# EAGLE design APRDL_2016_4L (EAGLE 7.2.0)
Assembly variants: X4

## Sheet 1 of 4
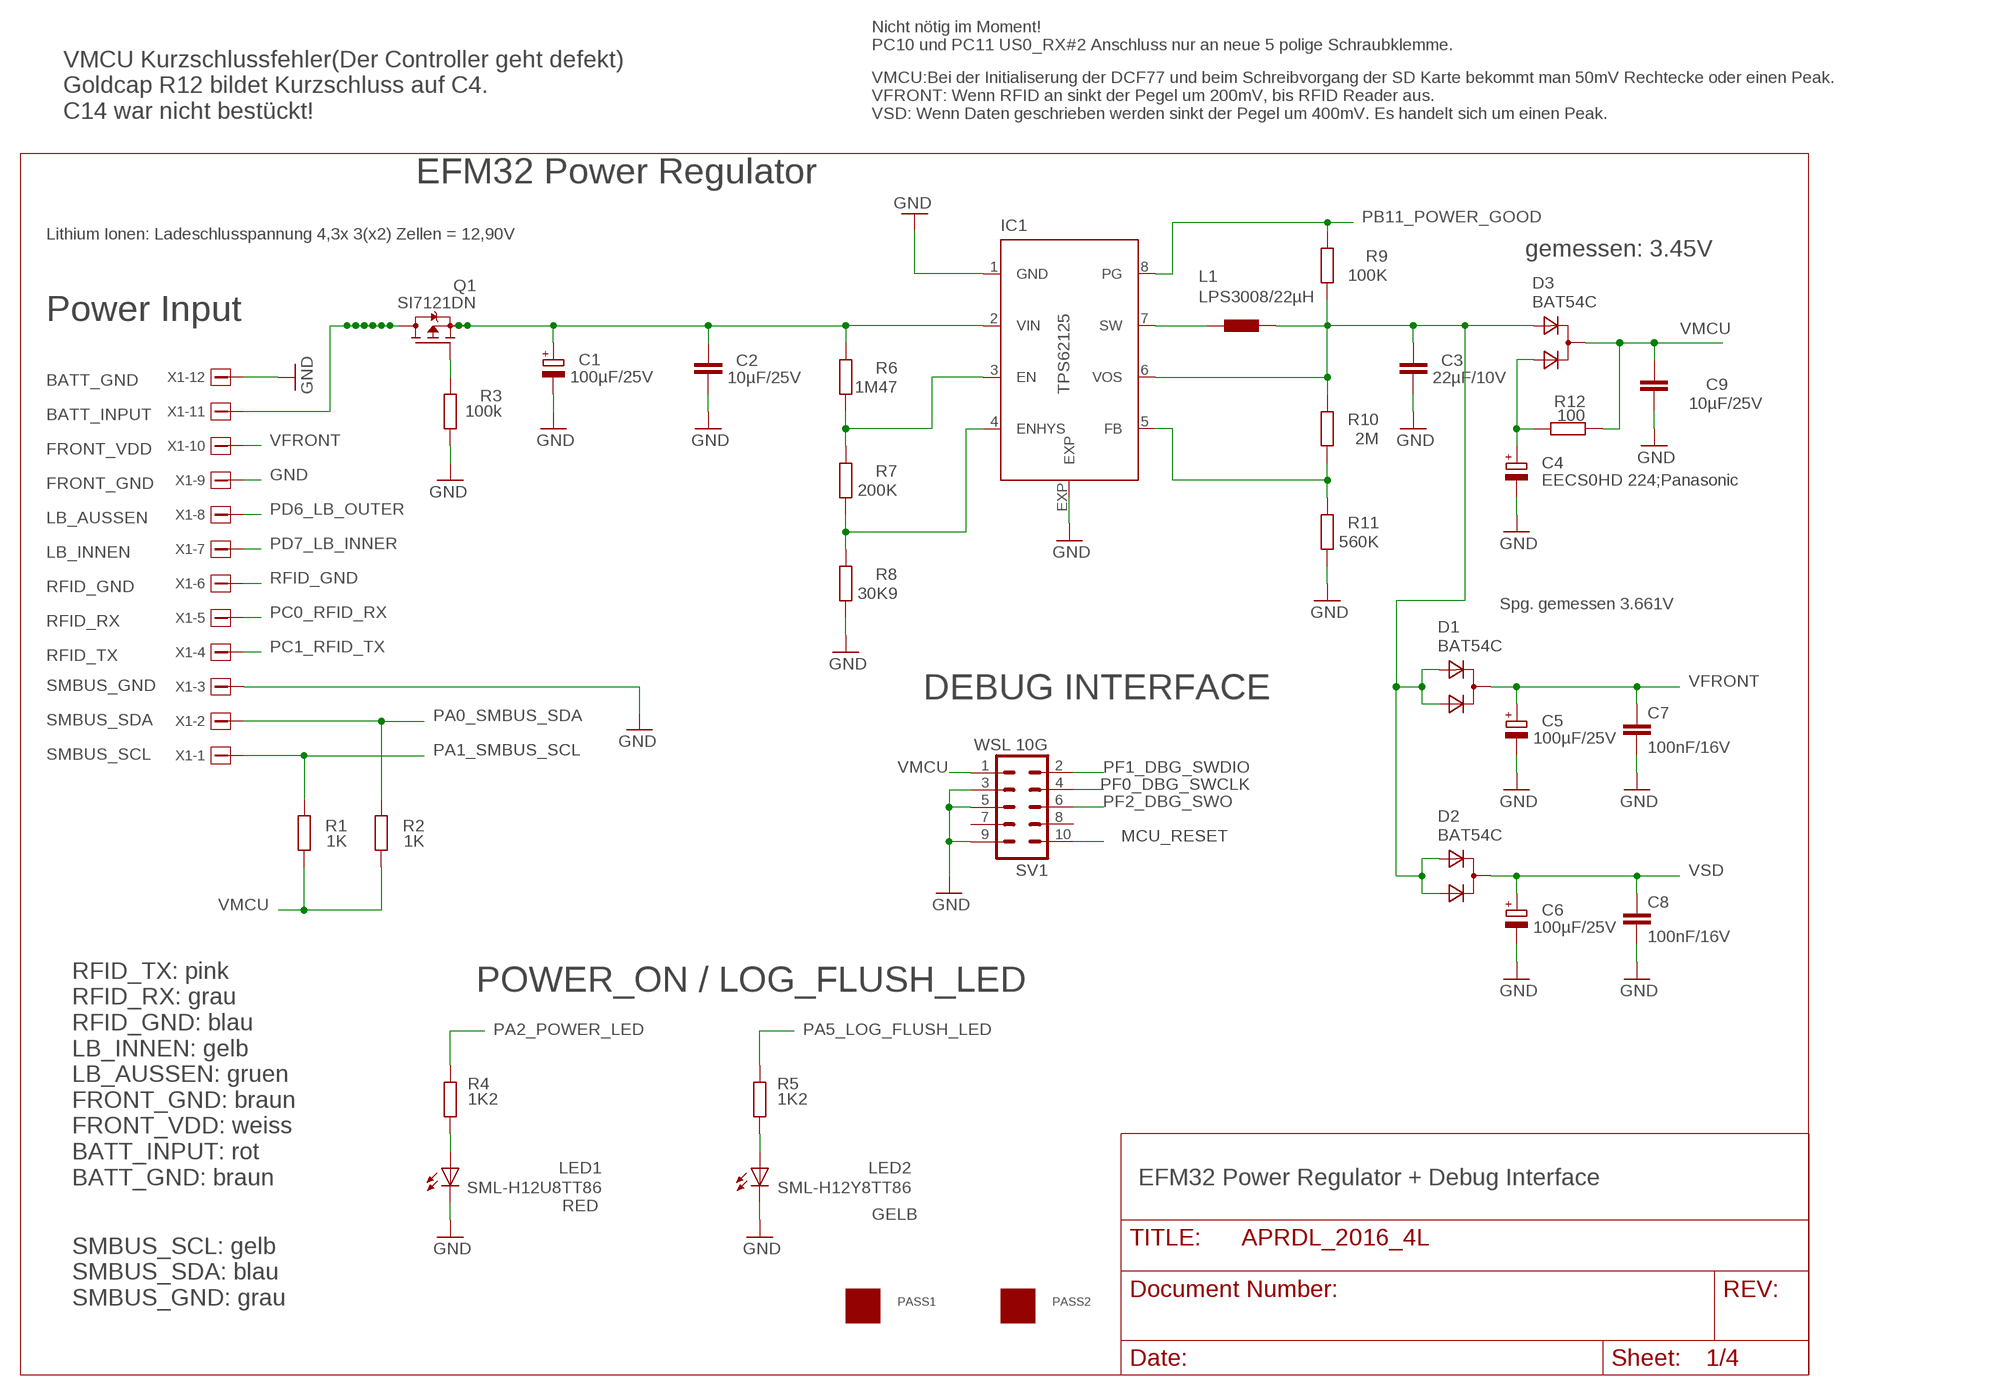
[diagram p0: schematic, sheet 1]

### Parts
C1  100µF/25V  CPOL-EUE  [PANASONIC_E]
C2  10µF/25V  C-EUC1206  [C1206]
C3  22µF/10V  C-EUC1206  [C1206]
C4  EECS0HD 224;Panasonic  GOLDCAPSPK-V  [GOLDCAPSPK-V]
C5  100µF/25V  CPOL-EUE  [PANASONIC_E]
C6  100µF/25V  CPOL-EUE  [PANASONIC_E]
C7  100nF/16V  C-EUC0805  [C0805]
C8  100nF/16V  C-EUC0805  [C0805]
C9  10µF/25V  C-EUC1206  [C1206]
D1  BAT54C  D2A_SOT23  [SOT-23@1]
D2  BAT54C  D2A_SOT23  [SOT-23@1]
D3  BAT54C  D2A_SOT23  [SOT-23@1]
IC1  TPS62125  [DSG_PWSO-N8_EXP]
L1  LPS3008/22µH  LPS3008  [LPS3008]
LED1  SML-H12U8TT86  LEDCHIPLED_0805  [CHIPLED_0805]
LED2  SML-H12Y8TT86  LEDCHIPLED_0805  [CHIPLED_0805]
PASS1  ROUND_1MM1.5  [ROUND2_1.5MM]
PASS2  ROUND_1MM1.5  [ROUND2_1.5MM]
Q1  SI7121DN  TRANSISTOR-FET_SI7113DN  [TRANSISTOR-FET_1212-8S]
R1  1K  R-EU_R0805  [R0805]
R2  1K  R-EU_R0805  [R0805]
R3  100k  R-EU_R0805  [R0805]
R4  1K2  R-EU_R0805  [R0805]
R5  1K2  R-EU_R0805  [R0805]
R6  1M47  R-EU_R0805  [R0805]
R7  200K  R-EU_R0805  [R0805]
R8  30K9  R-EU_R0805  [R0805]
R9  100K  R-EU_R0805  [R0805]
R10  2M  R-EU_R0805  [R0805]
R11  560K  R-EU_R0805  [R0805]
R12  100  R-EU_R0805  [R0805]
SV1  WSL 10G  ML10  [ML10]
X1  1803523  [1803523]

### Nets
BATT_INPUT: Q1.5(D) Q1.6(D) Q1.7(D) Q1.8(D) Q1.9(D) Q1.10(D) Q1.11(D) X1.11
GND: C1.- C2.2 C3.2 C4.- C5.- C6.- C7.2 C8.2 C9.1 IC1.1(GND) IC1.EXP LED1.C LED2.C R3.1 R8.1 R11.1 SV1.3 SV1.5 SV1.9 X1.3 X1.9 X1.12 ; also sheet 2,3,4
MCU_RESET: SV1.10 ; also sheet 2,3
N$1: IC1.3(EN) R6.1 R7.2
N$5: IC1.4(ENHYS) R7.1 R8.2
N$9: IC1.7(SW) L1.1
N$13: C1.+ C2.1 IC1.2(VIN) Q1.1(S) Q1.2(S) Q1.3(S) R6.2
N$17: LED2.A R5.2
N$19: IC1.5(FB) R10.1 R11.2
N$20: Q1.4(G) R3.2
N$21: C4.+ D3.2(A1) R12.2
N$29: LED1.A R4.2
PA0_SMBUS_SDA: R2.2 X1.2 ; also sheet 2
PA1_SMBUS_SCL: R1.2 X1.1 ; also sheet 2
PA2_POWER_LED: R4.1 ; also sheet 2
PA5_LOG_FLUSH_LED: R5.1 ; also sheet 2
PB11_POWER_GOOD: IC1.8(PG) R9.2 ; also sheet 2
PC0_RFID_RX: X1.5 ; also sheet 2
PC1_RFID_TX: X1.4 ; also sheet 2
PD6_LB_OUTER: X1.8 ; also sheet 2
PD7_LB_INNER: X1.7 ; also sheet 2
PF0_DBG_SWCLK: SV1.4 ; also sheet 2
PF1_DBG_SWDIO: SV1.2 ; also sheet 2
PF2_DBG_SWO: SV1.6 ; also sheet 2
RFID_GND: X1.6 ; also sheet 4
V1: C3.1 D1.2(A1) D1.3(A2) D2.2(A1) D2.3(A2) D3.3(A2) IC1.6(VOS) L1.2 R9.1 R10.2
VFRONT: C5.+ C7.1 D1.1(C) X1.10
VMCU: C9.2 D3.1(C) R1.1 R2.1 R12.1 SV1.1 ; also sheet 2,3,4
VSD: C6.+ C8.1 D2.1(C) ; also sheet 3
Unconnected: SV1.7 SV1.8

### Notes on the sheet
- Nicht nötig im Moment!
  PC10 und PC11 US0_RX#2 Anschluss nur an neue 5 polige Schraubklemme.
- VMCU Kurzschlussfehler(Der Controller geht defekt)
  Goldcap R12 bildet Kurzschluss auf C4.
  C14 war nicht bestückt!
- VMCU:Bei der Initialiserung der DCF77 und beim Schreibvorgang der SD Karte bekommt man 50mV Rechtecke oder einen Peak.
  VFRONT: Wenn RFID an sinkt der Pegel um 200mV, bis RFID Reader aus.
  VSD: Wenn Daten geschrieben werden sinkt der Pegel um 400mV. Es handelt sich um einen Peak.
- EFM32 Power Regulator
- Lithium Ionen: Ladeschlusspannung 4,3x 3(x2) Zellen = 12,90V
- gemessen: 3.45V
- Power Input
- BATT_GND
- BATT_INPUT
- FRONT_VDD
- FRONT_GND
- LB_AUSSEN
- LB_INNEN
- RFID_GND
- Spg. gemessen 3.661V
- RFID_RX
- RFID_TX
- SMBUS_GND
- DEBUG INTERFACE
- SMBUS_SDA
- SMBUS_SCL
- POWER_ON / LOG_FLUSH_LED
- RFID_TX: pink
  RFID_RX: grau
  RFID_GND: blau
  LB_INNEN: gelb
  LB_AUSSEN: gruen
  FRONT_GND: braun
  FRONT_VDD: weiss
  BATT_INPUT: rot
  BATT_GND: braun
- EFM32 Power Regulator + Debug Interface
- RED
- GELB
- SMBUS_SCL: gelb
  SMBUS_SDA: blau
  SMBUS_GND: grau

## Sheet 2 of 4
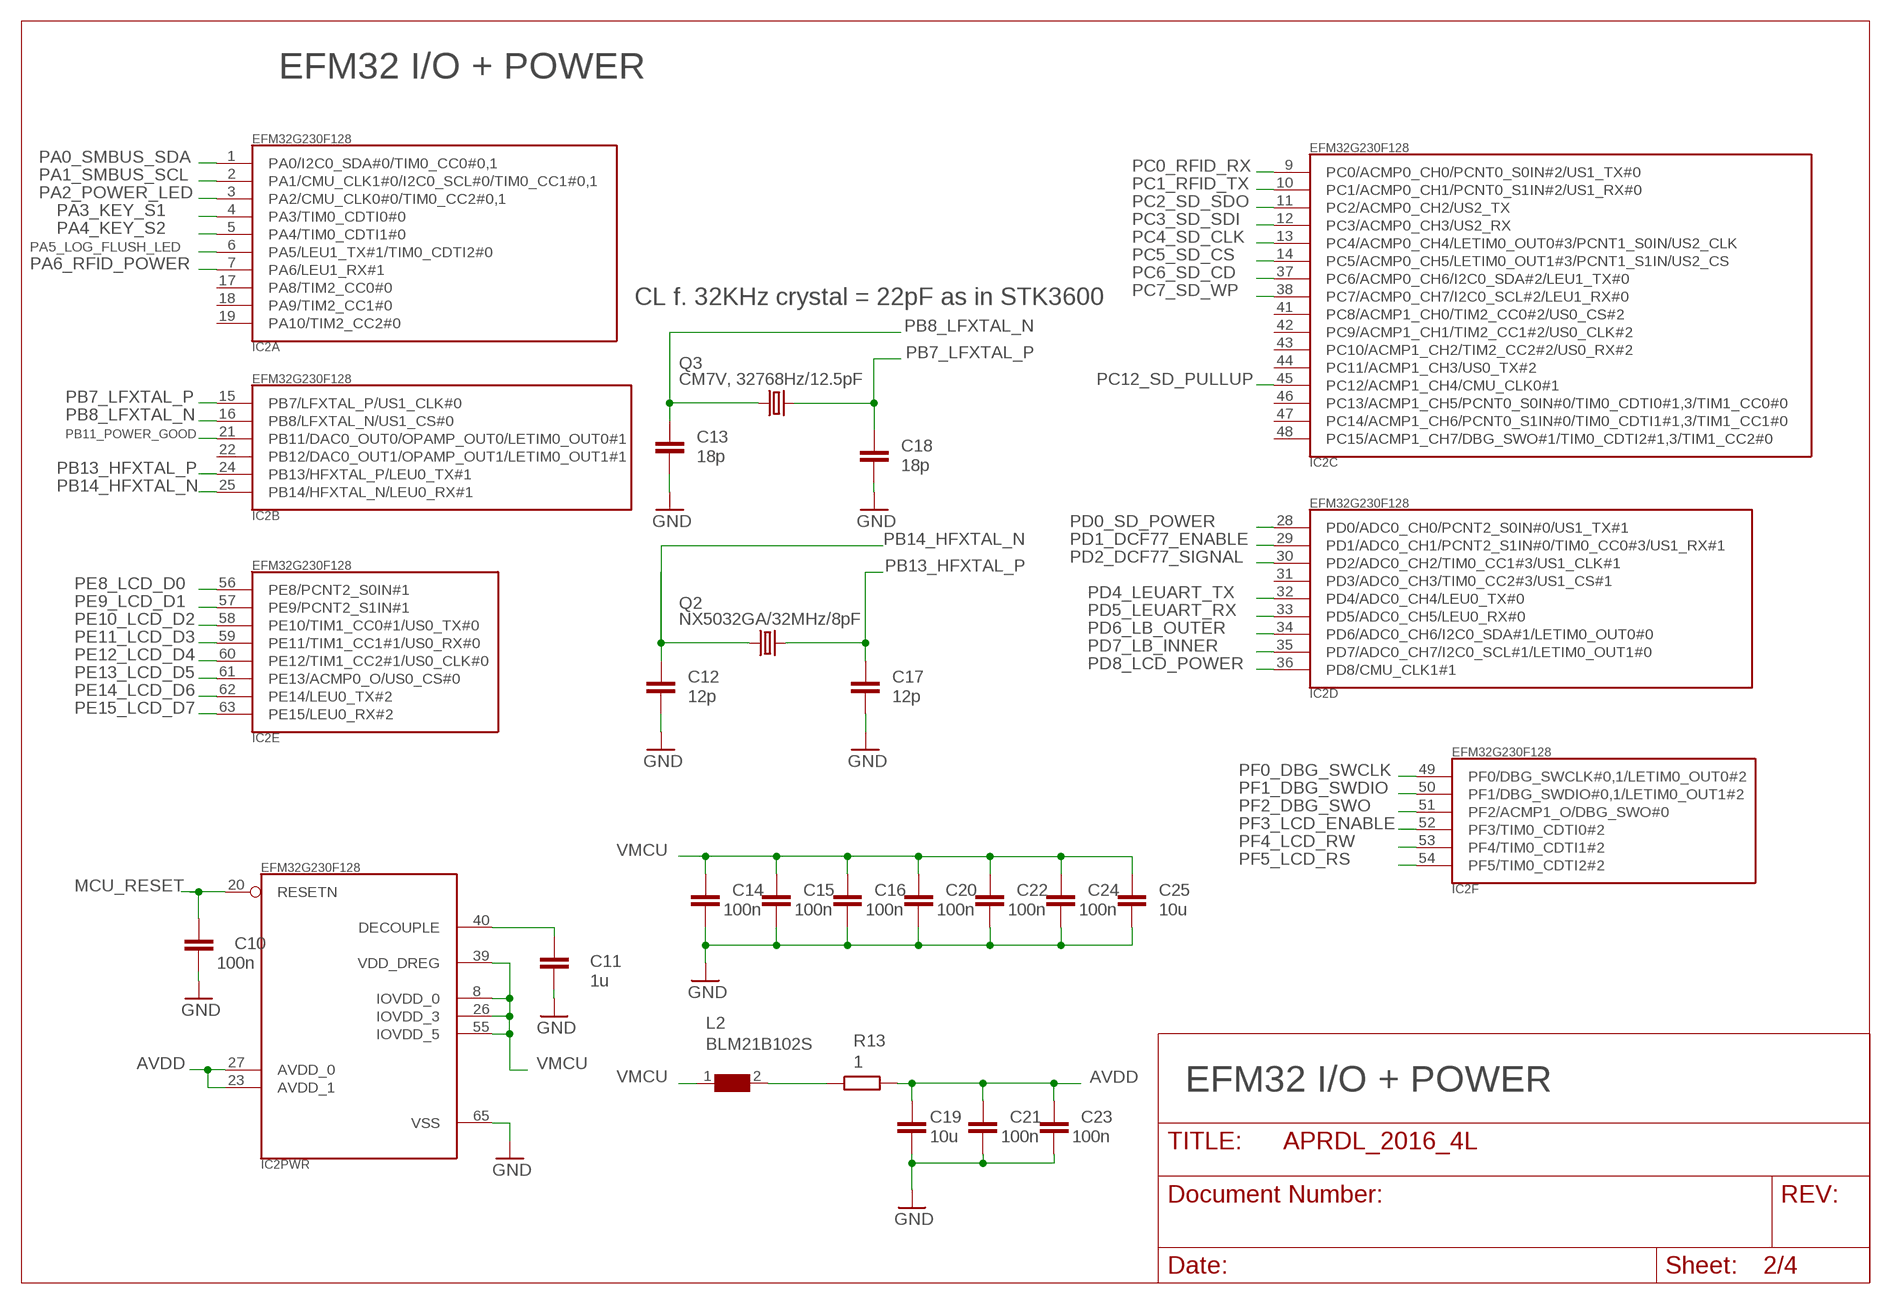
[diagram p1: schematic, sheet 2]

### Parts
C10  100n  C-EUC0805  [C0805]
C11  1u  C-EUC0805  [C0805]
C12  12p  C-EUC0805  [C0805]
C13  18p  C-EUC0805  [C0805]
C14  100n  C-EUC0805  [C0805]
C15  100n  C-EUC0805  [C0805]
C16  100n  C-EUC0805  [C0805]
C17  12p  C-EUC0805  [C0805]
C18  18p  C-EUC0805  [C0805]
C19  10u  C-EUC0805  [C0805]
C20  100n  C-EUC0805  [C0805]
C21  100n  C-EUC0805  [C0805]
C22  100n  C-EUC0805  [C0805]
C23  100n  C-EUC0805  [C0805]
C24  100n  C-EUC0805  [C0805]
C25  10u  C-EUC0805  [C0805]
IC2  EFM32G230F128  [QFN64]
L2  BLM21B102S  WE-CBF-7427920_0805  [0805]
Q2  NX5032GA/32MHz/8pF  CRYSTAL2P5.0X3.2  [CRYSTAL2P5.0X3.2]
Q3  CM7V, 32768Hz/12.5pF  CRYSTAL2P  [CRYSTAL2P3.2X1.5]
R13  1  R-EU_R0805  [R0805]

### Nets
AVDD [VCC]: C19.2 C21.2 C23.2 IC2.23(PWR:AVDD_1) IC2.27(PWR:AVDD_0) R13.2
GND: C10.1 C11.1 C12.1 C13.1 C14.1 C15.1 C16.1 C17.1 C18.1 C19.1 C20.1 C21.1 C22.1 C23.1 C24.1 C25.1 IC2.65(PWR:VSS) ; also sheet 1,3,4
MCU_RESET: C10.2 IC2.20(PWR:RESETN) ; also sheet 1,3
N$3: L2.2 R13.1
N$30: C11.2 IC2.40(PWR:DECOUPLE)
PA0_SMBUS_SDA: IC2.1(A:PA0/I2C0_SDA#0/TIM0_CC0#0,1) ; also sheet 1
PA1_SMBUS_SCL: IC2.2(A:PA1/CMU_CLK1#0/I2C0_SCL#0/TIM0_CC1#0,1) ; also sheet 1
PA2_POWER_LED: IC2.3(A:PA2/CMU_CLK0#0/TIM0_CC2#0,1) ; also sheet 1
PA3_KEY_S1: IC2.4(A:PA3/TIM0_CDTI0#0) ; also sheet 3
PA4_KEY_S2: IC2.5(A:PA4/TIM0_CDTI1#0) ; also sheet 3
PA5_LOG_FLUSH_LED: IC2.6(A:PA5/LEU1_TX#1/TIM0_CDTI2#0) ; also sheet 1
PA6_RFID_POWER: IC2.7(A:PA6/LEU1_RX#1) ; also sheet 4
PB7_LFXTAL_P: C18.2 IC2.15(B:PB7/LFXTAL_P/US1_CLK#0) Q3.2
PB8_LFXTAL_N: C13.2 IC2.16(B:PB8/LFXTAL_N/US1_CS#0) Q3.1
PB11_POWER_GOOD: IC2.21(B:PB11/DAC0_OUT0/OPAMP_OUT0/LETIM0_OUT0#1) ; also sheet 1
PB13_HFXTAL_P: C17.2 IC2.24(B:PB13/HFXTAL_P/LEU0_TX#1) Q2.2
PB14_HFXTAL_N: C12.2 IC2.25(B:PB14/HFXTAL_N/LEU0_RX#1) Q2.1
PC0_RFID_RX: IC2.9(C:PC0/ACMP0_CH0/PCNT0_S0IN#2/US1_TX#0) ; also sheet 1
PC1_RFID_TX: IC2.10(C:PC1/ACMP0_CH1/PCNT0_S1IN#2/US1_RX#0) ; also sheet 1
PC2_SD_SDO: IC2.11(C:PC2/ACMP0_CH2/US2_TX) ; also sheet 3
PC3_SD_SDI: IC2.12(C:PC3/ACMP0_CH3/US2_RX) ; also sheet 3
PC4_SD_CLK: IC2.13(C:PC4/ACMP0_CH4/LETIM0_OUT0#3/PCNT1_S0IN/US2_CLK) ; also sheet 3
PC5_SD_CS: IC2.14(C:PC5/ACMP0_CH5/LETIM0_OUT1#3/PCNT1_S1IN/US2_CS) ; also sheet 3
PC6_SD_CD: IC2.37(C:PC6/ACMP0_CH6/I2C0_SDA#2/LEU1_TX#0) ; also sheet 3
PC7_SD_WP: IC2.38(C:PC7/ACMP0_CH7/I2C0_SCL#2/LEU1_RX#0) ; also sheet 3
PC12_SD_PULLUP: IC2.45(C:PC12/ACMP1_CH4/CMU_CLK0#1) ; also sheet 3
PD0_SD_POWER: IC2.28(D:PD0/ADC0_CH0/PCNT2_S0IN#0/US1_TX#1) ; also sheet 3
PD1_DCF77_ENABLE: IC2.29(D:PD1/ADC0_CH1/PCNT2_S1IN#0/TIM0_CC0#3/US1_RX#1) ; also sheet 3
PD2_DCF77_SIGNAL: IC2.30(D:PD2/ADC0_CH2/TIM0_CC1#3/US1_CLK#1) ; also sheet 3
PD4_LEUART_TX: IC2.32(D:PD4/ADC0_CH4/LEU0_TX#0) ; also sheet 3
PD5_LEUART_RX: IC2.33(D:PD5/ADC0_CH5/LEU0_RX#0) ; also sheet 3
PD6_LB_OUTER: IC2.34(D:PD6/ADC0_CH6/I2C0_SDA#1/LETIM0_OUT0#0) ; also sheet 1
PD7_LB_INNER: IC2.35(D:PD7/ADC0_CH7/I2C0_SCL#1/LETIM0_OUT1#0) ; also sheet 1
PD8_LCD_POWER: IC2.36(D:PD8/CMU_CLK1#1) ; also sheet 4
PE8_LCD_D0: IC2.56(E:PE8/PCNT2_S0IN#1) ; also sheet 4
PE9_LCD_D1: IC2.57(E:PE9/PCNT2_S1IN#1) ; also sheet 4
PE10_LCD_D2: IC2.58(E:PE10/TIM1_CC0#1/US0_TX#0) ; also sheet 4
PE11_LCD_D3: IC2.59(E:PE11/TIM1_CC1#1/US0_RX#0) ; also sheet 4
PE12_LCD_D4: IC2.60(E:PE12/TIM1_CC2#1/US0_CLK#0) ; also sheet 4
PE13_LCD_D5: IC2.61(E:PE13/ACMP0_O/US0_CS#0) ; also sheet 4
PE14_LCD_D6: IC2.62(E:PE14/LEU0_TX#2) ; also sheet 4
PE15_LCD_D7: IC2.63(E:PE15/LEU0_RX#2) ; also sheet 4
PF0_DBG_SWCLK: IC2.49(F:PF0/DBG_SWCLK#0,1/LETIM0_OUT0#2) ; also sheet 1
PF1_DBG_SWDIO: IC2.50(F:PF1/DBG_SWDIO#0,1/LETIM0_OUT1#2) ; also sheet 1
PF2_DBG_SWO: IC2.51(F:PF2/ACMP1_O/DBG_SWO#0) ; also sheet 1
PF3_LCD_ENABLE: IC2.52(F:PF3/TIM0_CDTI0#2) ; also sheet 4
PF4_LCD_RW: IC2.53(F:PF4/TIM0_CDTI1#2) ; also sheet 4
PF5_LCD_RS: IC2.54(F:PF5/TIM0_CDTI2#2) ; also sheet 4
VMCU: C14.2 C15.2 C16.2 C20.2 C22.2 C24.2 C25.2 IC2.8(PWR:IOVDD_0) IC2.26(PWR:IOVDD_3) IC2.39(PWR:VDD_DREG) IC2.55(PWR:IOVDD_5) L2.1 ; also sheet 1,3,4
Unconnected: IC2.17(A:PA8/TIM2_CC0#0) IC2.18(A:PA9/TIM2_CC1#0) IC2.19(A:PA10/TIM2_CC2#0) IC2.22(B:PB12/DAC0_OUT1/OPAMP_OUT1/LETIM0_OUT1#1) IC2.31(D:PD3/ADC0_CH3/TIM0_CC2#3/US1_CS#1) IC2.41(C:PC8/ACMP1_CH0/TIM2_CC0#2/US0_CS#2) IC2.42(C:PC9/ACMP1_CH1/TIM2_CC1#2/US0_CLK#2) IC2.43(C:PC10/ACMP1_CH2/TIM2_CC2#2/US0_RX#2) IC2.44(C:PC11/ACMP1_CH3/US0_TX#2) IC2.46(C:PC13/ACMP1_CH5/PCNT0_S0IN#0/TIM0_CDTI0#1,3/TIM1_CC0#0) IC2.47(C:PC14/ACMP1_CH6/PCNT0_S1IN#0/TIM0_CDTI1#1,3/TIM1_CC1#0) IC2.48(C:PC15/ACMP1_CH7/DBG_SWO#1/TIM0_CDTI2#1,3/TIM1_CC2#0)

### Notes on the sheet
- EFM32 I/O + POWER
- CL f. 32KHz crystal = 22pF as in STK3600
- EFM32 I/O + POWER

## Sheet 3 of 4
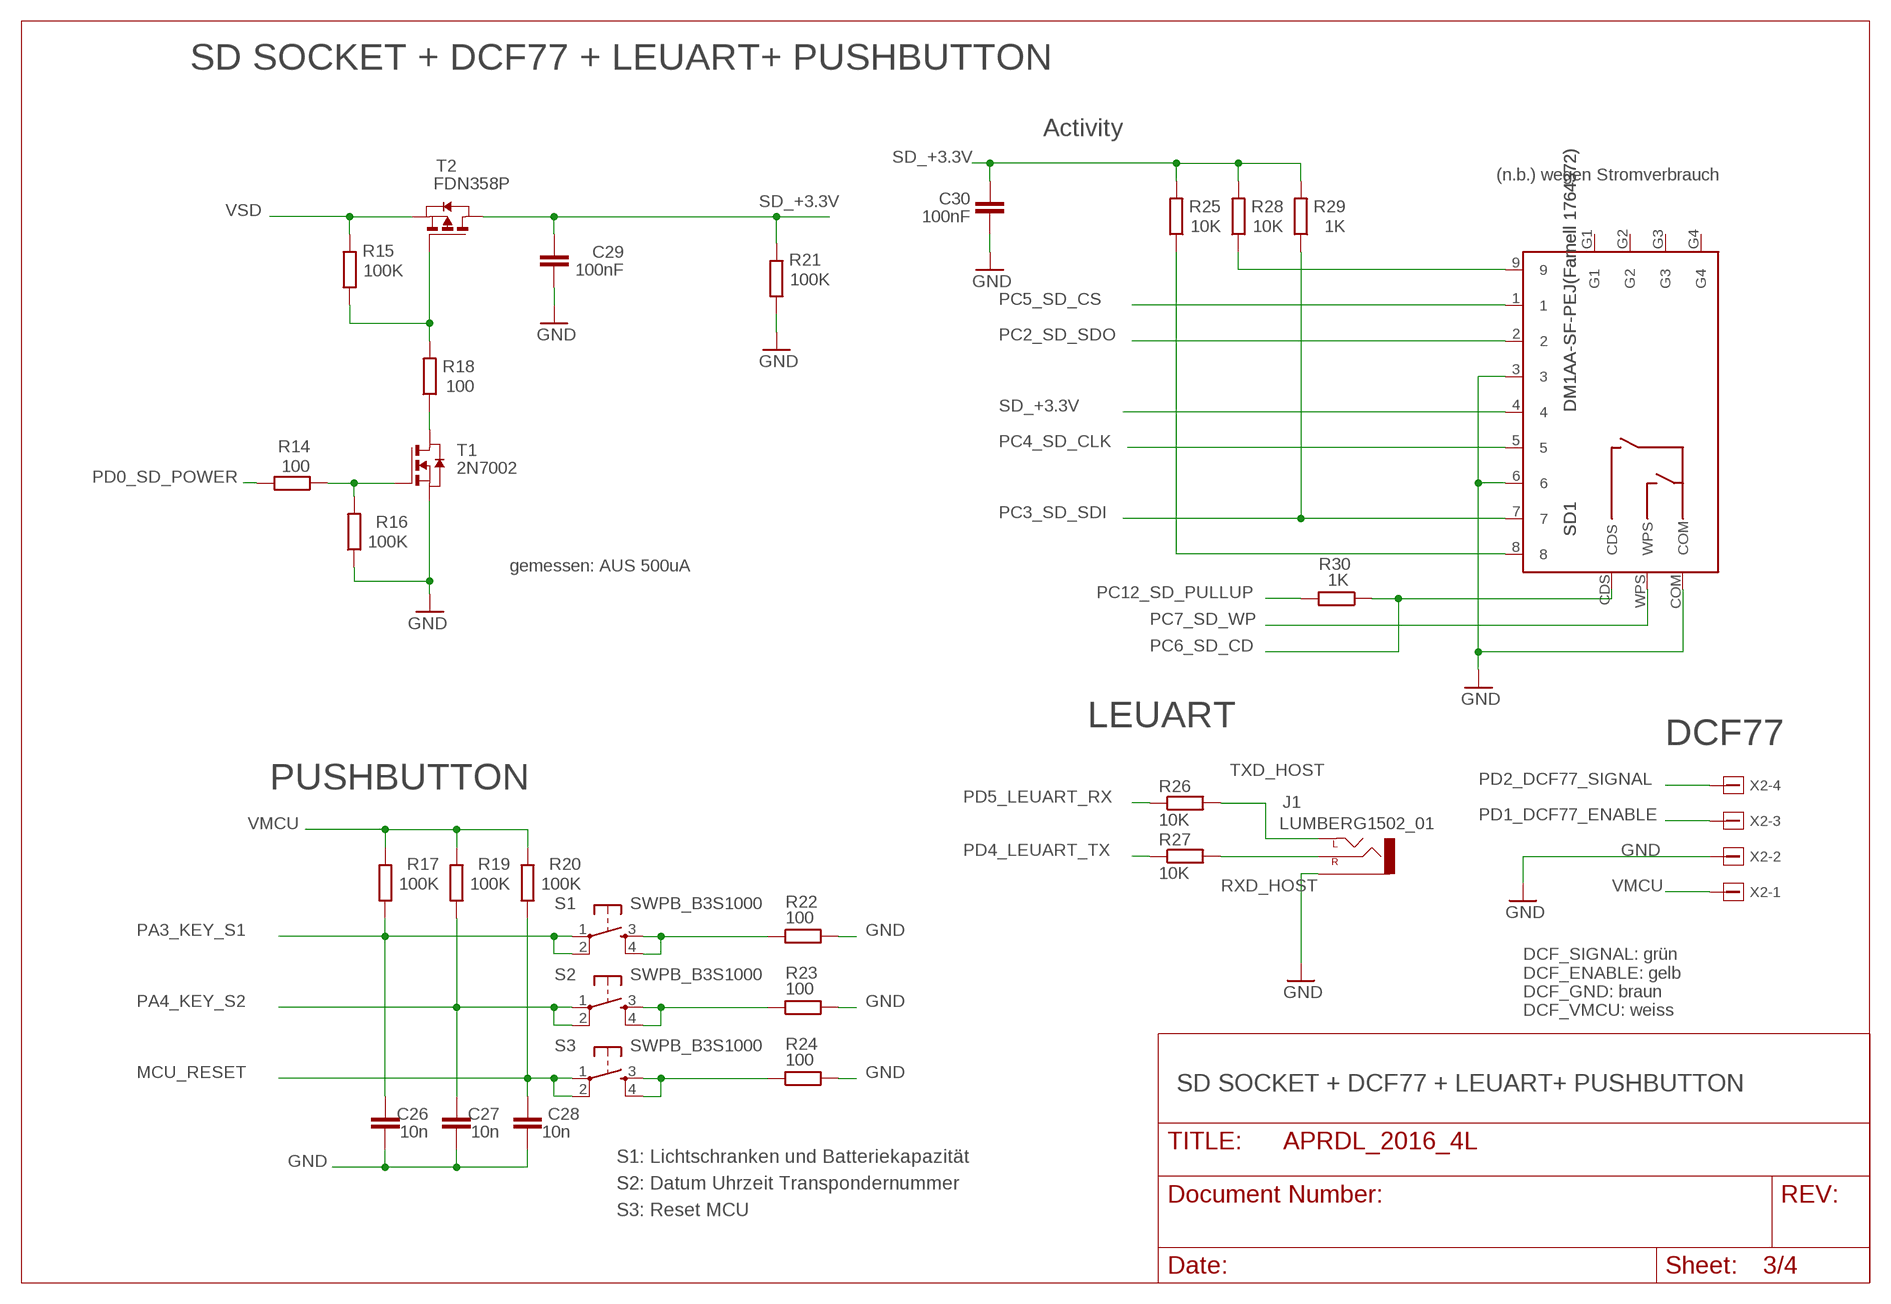
[diagram p2: schematic, sheet 3]

### Parts
C26  10n  C-EUC0603  [C0603]
C27  10n  C-EUC0603  [C0603]
C28  10n  C-EUC0603  [C0603]
C29  100nF  C-EUC0603  [C0603]
C30  100nF  C-EUC0603  [C0603]
J1  LUMBERG1502_01  [LUMBERG1502_01]
R14  100  R-EU_R0805  [R0805]
R15  100K  R-EU_R0805  [R0805]
R16  100K  R-EU_R0805  [R0805]
R17  100K  R-EU_R0805  [R0805]
R18  100  R-EU_R0805  [R0805]
R19  100K  R-EU_R0805  [R0805]
R20  100K  R-EU_R0805  [R0805]
R21  100K  R-EU_R0805  [R0805]
R22  100  R-EU_R0805  [R0805]
R23  100  R-EU_R0805  [R0805]
R24  100  R-EU_R0805  [R0805]
R25  10K  R-EU_R0805  [R0805]
R26  10K  R-EU_R0805  [R0805]
R27  10K  R-EU_R0805  [R0805]
R28  10K  R-EU_R0805  [R0805]
R29  1K  R-EU_R0805  [R0805]
R30  1K  R-EU_R0805  [R0805]
S1  SWPB_B3S1000  DTSM-6  [DTSM-6]
S2  SWPB_B3S1000  DTSM-6  [DTSM-6]
S3  SWPB_B3S1000  DTSM-6  [DTSM-6]
SD1  DM1AA-SF-PEJ(Farnell 1764372)  DM1AA-SF-PEJ  [DM1AA-SF-PEJ]
T1  2N7002  ZETEX_NMOSSOT23  [ZETEX_SOT-23]
T2  FDN358P  ZETEX_PMOSSOT23  [ZETEX_SOT-23]
X2  1803442  [1803442]

### Nets
GND: C26.1 C27.1 C28.1 C29.2 C30.2 J1.P$1(1-SLEEVE) R16.1 R21.1 R22.2 R23.2 R24.2 SD1.3 SD1.6 SD1.COM T1.2(S) X2.2 ; also sheet 1,2,4
MCU_RESET: C28.2 R20.1 S3.1 S3.2 ; also sheet 1,2
N$4: R15.1 R18.2 T2.3(G)
N$7: R18.1 T1.1(D)
N$11: R14.1 R16.2 T1.3(G)
N$16: R28.1 SD1.9
N$18: R25.1 SD1.8
N$23: R22.1 S1.3 S1.4
N$24: R23.1 S2.3 S2.4
N$26: R24.1 S3.3 S3.4
PA3_KEY_S1: C26.2 R17.1 S1.1 S1.2 ; also sheet 2
PA4_KEY_S2: C27.2 R19.1 S2.1 S2.2 ; also sheet 2
PC2_SD_SDO: SD1.2 ; also sheet 2
PC3_SD_SDI: R29.1 SD1.7 ; also sheet 2
PC4_SD_CLK: SD1.5 ; also sheet 2
PC5_SD_CS: SD1.1 ; also sheet 2
PC6_SD_CD: R30.1 SD1.CDS ; also sheet 2
PC7_SD_WP: SD1.WPS ; also sheet 2
PC12_SD_PULLUP: R30.2 ; also sheet 2
PD0_SD_POWER: R14.2 ; also sheet 2
PD1_DCF77_ENABLE: X2.3 ; also sheet 2
PD2_DCF77_SIGNAL: X2.4 ; also sheet 2
PD4_LEUART_TX: R27.1 ; also sheet 2
PD5_LEUART_RX: R26.1 ; also sheet 2
RXD_HOST: J1.P$3(3-RIGHT) R27.2
SD_+3.3V: C29.1 C30.1 R21.2 R25.2 R28.2 R29.2 SD1.4 T2.1(D)
TXD_HOST: J1.P$2(2-LEFT) R26.2
VMCU: R17.2 R19.2 R20.2 X2.1 ; also sheet 1,2,4
VSD: R15.2 T2.2(S) ; also sheet 1
Unconnected: SD1.G1 SD1.G2 SD1.G3 SD1.G4

### Notes on the sheet
- SD SOCKET + DCF77 + LEUART+ PUSHBUTTON
- Activity
- (n.b.) wegen Stromverbrauch
- gemessen: AUS 500uA
- LEUART
- DCF77
- PUSHBUTTON
- DCF_SIGNAL: grün
  DCF_ENABLE: gelb
  DCF_GND: braun
  DCF_VMCU: weiss
- SD SOCKET + DCF77 + LEUART+ PUSHBUTTON
- S1: Lichtschranken und Batteriekapazität
- S2: Datum Uhrzeit Transpondernummer
- S3: Reset MCU

## Sheet 4 of 4
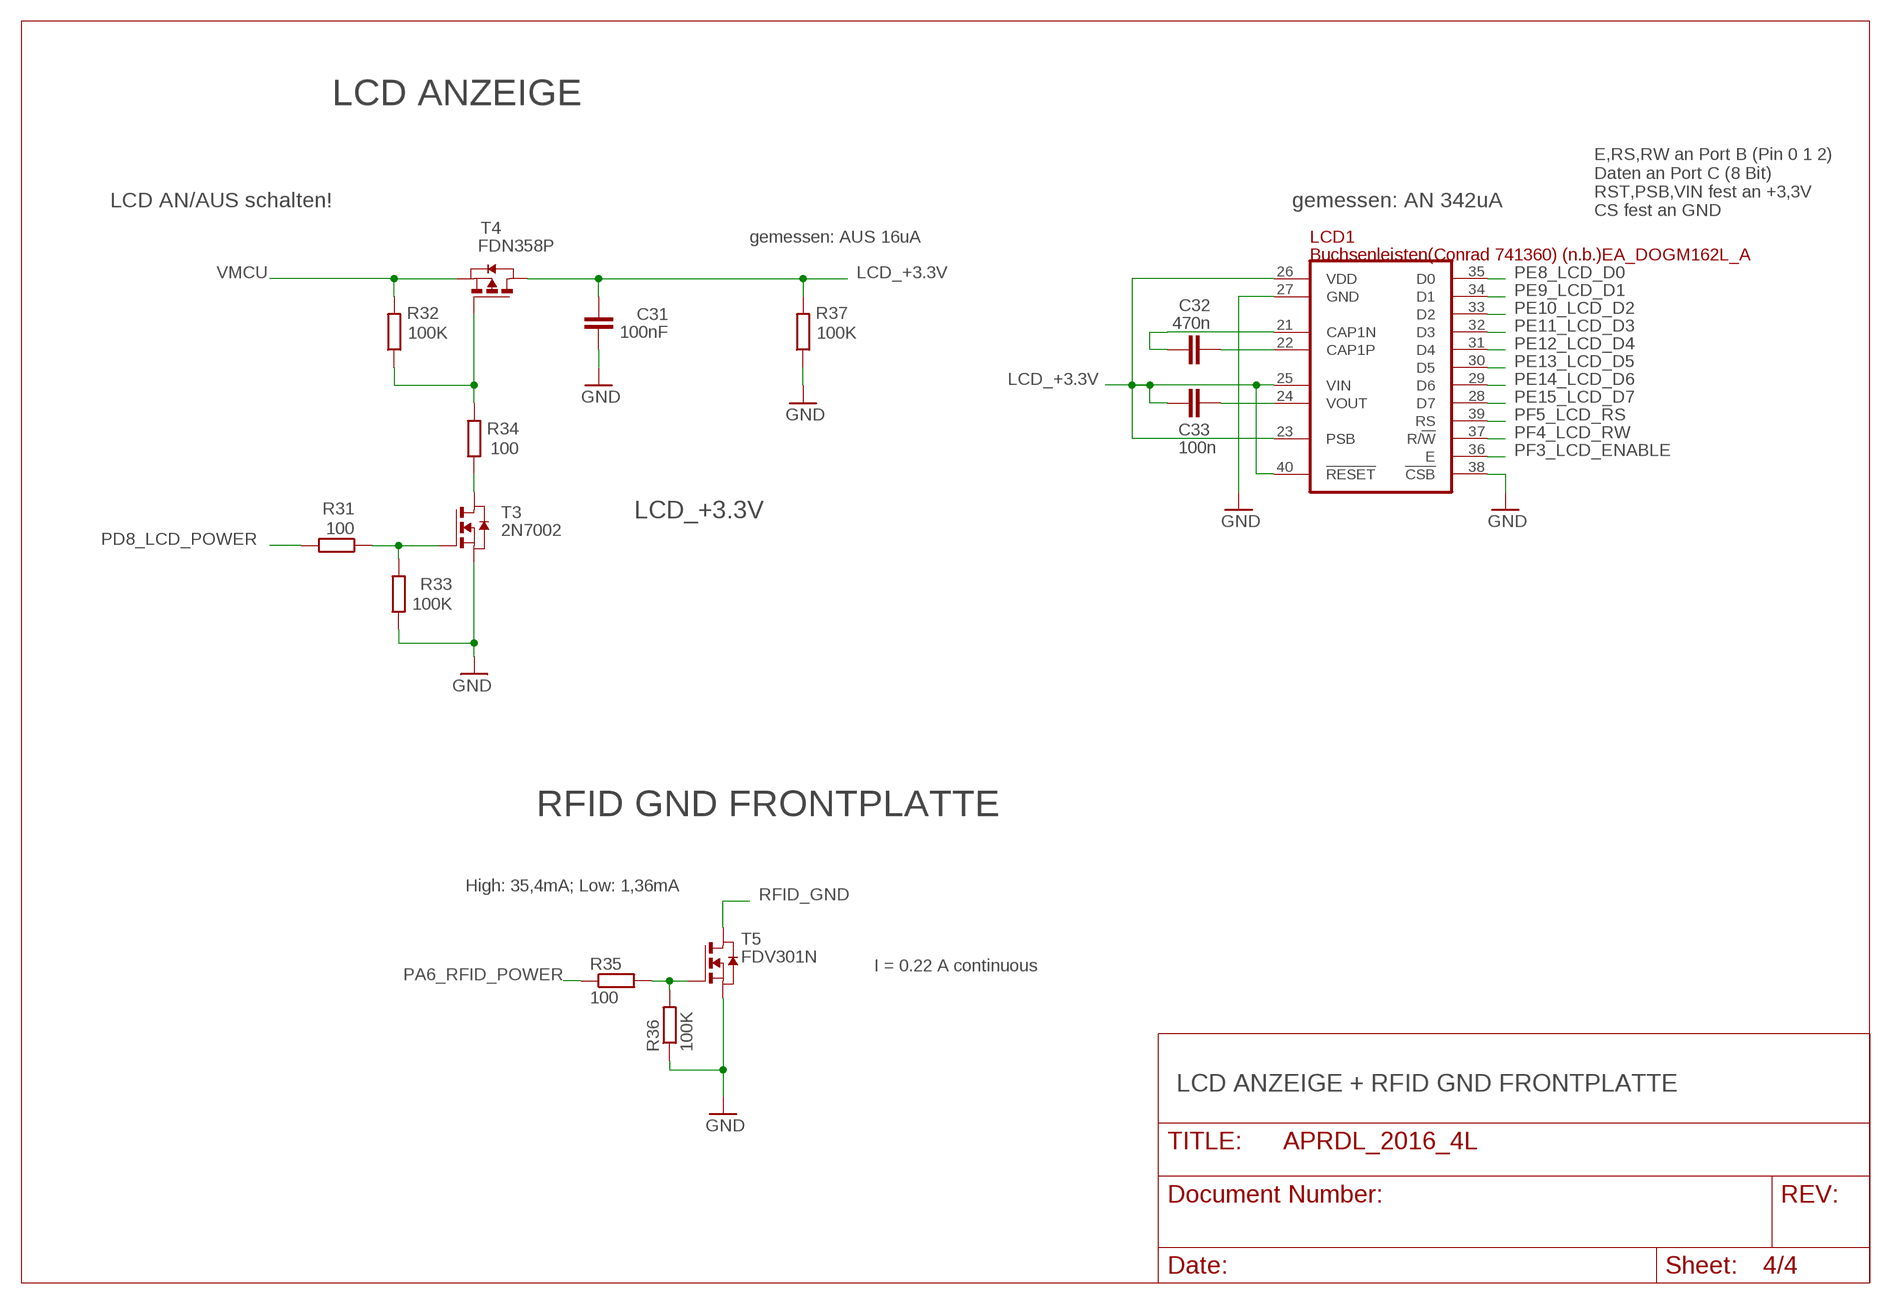
[diagram p3: schematic, sheet 4]

### Parts
C31  100nF  C-EUC0603  [C0603]
C32  470n  C-EUC0805  [C0805]
C33  100n  C-EUC1206  [C1206]
LCD1  Buchsenleisten(Conrad 741360) (n.b.)EA_DOGM162L_A  EA_DOGM162  [EA_DOGM]
R31  100  R-EU_R0805  [R0805]
R32  100K  R-EU_R0805  [R0805]
R33  100K  R-EU_R0805  [R0805]
R34  100  R-EU_R0805  [R0805]
R35  100  R-EU_R0805  [R0805]
R36  100K  R-EU_R0805  [R0805]
R37  100K  R-EU_R0805  [R0805]
T3  2N7002  ZETEX_NMOSSOT23  [ZETEX_SOT-23]
T4  FDN358P  ZETEX_PMOSSOT23  [ZETEX_SOT-23]
T5  FDV301N  NMOSSOT23  [SOT-23]

### Nets
GND: C31.2 LCD1.27(GND) LCD1.38(!CSB!) R33.1 R36.1 R37.1 T3.2(S) T5.2(S) ; also sheet 1,2,3
LCD_+3.3V: C31.1 C33.2 LCD1.23(PSB) LCD1.25(VIN) LCD1.26(VDD) LCD1.40(!RESET!) R37.2 T4.1(D)
N$2: R35.2 R36.2 T5.3(G)
N$6: R32.1 R34.2 T4.3(G)
N$10: R34.1 T3.1(D)
N$12: R31.1 R33.2 T3.3(G)
N$25: C32.2 LCD1.22(CAP1P)
N$27: C32.1 LCD1.21(CAP1N)
N$28: C33.1 LCD1.24(VOUT)
PA6_RFID_POWER: R35.1 ; also sheet 2
PD8_LCD_POWER: R31.2 ; also sheet 2
PE8_LCD_D0: LCD1.35(D0) ; also sheet 2
PE9_LCD_D1: LCD1.34(D1) ; also sheet 2
PE10_LCD_D2: LCD1.33(D2) ; also sheet 2
PE11_LCD_D3: LCD1.32(D3) ; also sheet 2
PE12_LCD_D4: LCD1.31(D4) ; also sheet 2
PE13_LCD_D5: LCD1.30(D5) ; also sheet 2
PE14_LCD_D6: LCD1.29(D6) ; also sheet 2
PE15_LCD_D7: LCD1.28(D7) ; also sheet 2
PF3_LCD_ENABLE: LCD1.36(E) ; also sheet 2
PF4_LCD_RW: LCD1.37(R/!W!) ; also sheet 2
PF5_LCD_RS: LCD1.39(RS) ; also sheet 2
RFID_GND: T5.1(D) ; also sheet 1
VMCU: R32.2 T4.2(S) ; also sheet 1,2,3

### Notes on the sheet
- LCD ANZEIGE
- LCD AN/AUS schalten! | gemessen: AN 342uA
- E,RS,RW an Port B (Pin 0 1 2)
  Daten an Port C (8 Bit)
  RST,PSB,VIN fest an +3,3V
  CS fest an GND
- gemessen: AUS 16uA
- LCD_+3.3V
- RFID GND FRONTPLATTE
- High: 35,4mA; Low: 1,36mA
- I = 0.22 A continuous
- LCD ANZEIGE + RFID GND FRONTPLATTE

## Library data of the parts
C1 C5 C6 = resistor:CPOL-EU: POLARIZED CAPACITOR, European symbol
C2 C3 C7-C25 C32 C33 = rcl:C-EU: CAPACITOR, European symbol
C4 = EdM 2011:GOLDCAP
C26-C31 = resistor:C-EU: CAPACITOR, European symbol
D1-D3 = zetex:D2A_SOT23: Dual DIODE
IC1 = texas_Kiermaier:TPS62125
IC2 = EnergyMicro:EFM32G230F128: EFM32G230F128 Gecko Microcontroller in 9mm x 9mm QFN64 package
J1 = EdM 2011:LUMBERG1502_01
L1 = inductors:LPS3008
L2 = WE-CBF:WE-CBF: SMD EMI Suppression Ferrite Beads WE-CBF - Excellent anti-EMI properties - Low DC-restistance - Impedances till 3000 ohms - Rated current up to 6 A -- Reliable Ni-Sn electrodes -- Perfect as data lined filter and for uncoupling of distribution voltage; MPN: 7427920; OC_FARNELL: 1635707; OC_NEWARK: 08P2358; PACKAGE: IND-0805; SUPPLIER: Wuerth Elektronik
LCD1 = ea:EA_DOGM162: ELECTRONIC ASSEMBYL GmbH EA DOGM162-A EA DOGM081-A EA DOGM163-A
LED1 LED2 = led:LED: LED OSRAM: - CHIPLED LG R971, LG N971, LY N971, LG Q971, LY Q971, LO R971, LY R971 LH N974, LH R974 LS Q976, LO Q976, LY Q976 LO Q996 - Hyper CHIPLED LW Q18S LB Q993, LB Q99A, LB R99A - SideLED LS A670, LO A670, LY A670, LG A670, LP A670 LB A673, LV A673, LT A673, LW A673 LH A674 LY A675 LS A676, LA A676, LO A676, LY A676, LW A676 LS A679, LY A679, LG A679 - Hyper Micro SIDELED® LS Y876, LA Y876, LO Y876, LY Y876 LT Y87S - SmartLED LW L88C, LW L88S LB L89C, LB L89S, LG L890 LS L89K, LO L89K, LY L89K LS L896, LA L896, LO L896, LY L896 - TOPLED LS T670, LO T670, LY T670, LG T670, LP T670 LSG T670, LSP T670, LSY T670, LOP T670, LYG T670 LG T671, LOG T671, LSG T671 LB T673, LV T673, LT T673, LW T673 LH T674 LS T676, LA T676, LO T676, LY T676, LB T676, LH T676, LSB T676, LW T676 LB T67C, LV T67C, LT T67C, LS T67K, LO T67K, LY T67K, LW E67C LS E67B, LA E67B, LO E67B, LY E67B, LB E67C, LV E67C, LT E67C LW T67C LS T679, LY T679, LG T679 LS T770, LO T770, LY T770, LG T770, LP T770 LB T773, LV T773, LT T773, LW T773 LH T774 LS E675, LA E675, LY E675, LS T675 LS T776, LA T776, LO T776, LY T776, LB T776 LHGB T686 LT T68C, LB T68C - Hyper Mini TOPLED® LB M676 - Mini TOPLED Santana® LG M470 LS M47K, LO M47K, LY M47K Source: http://www.osram.convergy.de LUXEON: - LUMILED® LXK2-PW12-R00, LXK2-PW12-S00, LXK2-PW14-U00, LXK2-PW14-V00 LXK2-PM12-R00, LXK2-PM12-S00, LXK2-PM14-U00 LXK2-PE12-Q00, LXK2-PE12-R00, LXK2-PE12-S00, LXK2-PE14-T00, LXK2-PE14-U00 LXK2-PB12-K00, LXK2-PB12-L00, LXK2-PB12-M00, LXK2-PB14-N00, LXK2-PB14-P00, LXK2-PB14-Q00 LXK2-PR12-L00, LXK2-PR12-M00, LXK2-PR14-Q00, LXK2-PR14-R00 LXK2-PD12-Q00, LXK2-PD12-R00, LXK2-PD12-S00 LXK2-PH12-R00, LXK2-PH12-S00 LXK2-PL12-P00, LXK2-PL12-Q00, LXK2-PL12-R00 Source: www.luxeon.com KINGBRIGHT: KA-3528ASYC Source: www.kingbright.com
PASS1 PASS2 = Passermarks:ROUND_1MM
Q1 = dcdc_BB3_V0:TRANSISTOR-FET_SI7113DN
Q2 Q3 = EdM 2011:CRYSTAL2P: Quarz Crystal
R1-R5 R14-R25 R28-R34 R37 = resistor:R-EU_: RESISTOR, European symbol
R6-R13 R26 R27 R35 R36 = rcl:R-EU_: RESISTOR, European symbol
S1-S3 = switch-tact:DTSM-6
SD1 = con-hirose:DM1AA-SF-PEJ
SV1 = con-harting-ml:ML10: HARTING; OC_FARNELL: unknown; OC_NEWARK: unknown
T1 T3 = SESA:ZETEX_NMOSSOT23: MOS FET
T2 T4 = SESA:ZETEX_PMOSSOT23: MOS FET
T5 = zetex:NMOSSOT23: MOS FET; OC_FARNELL: unknown; OC_NEWARK: unknown
X1 = con-phoenix-3.81:1803523
X2 = con-phoenix-3.81:1803442

## Net classes
1 GND: width 0.2 mm
2 VCC: width 0.25 mm

## Board
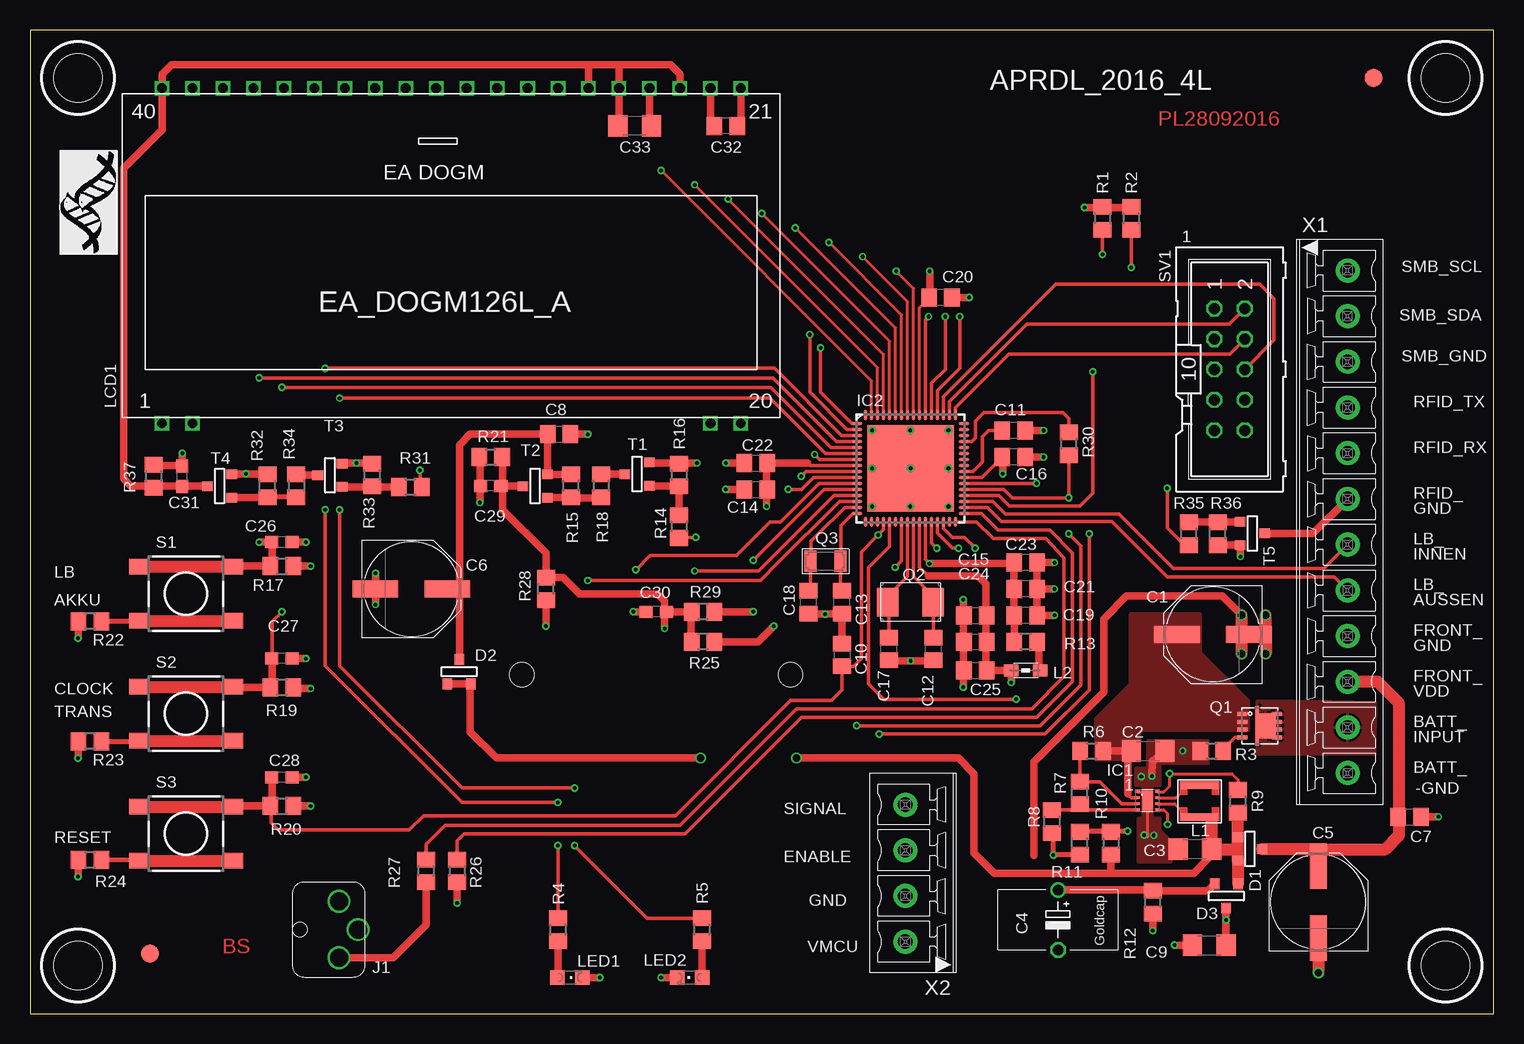
[diagram p4: board, top side]
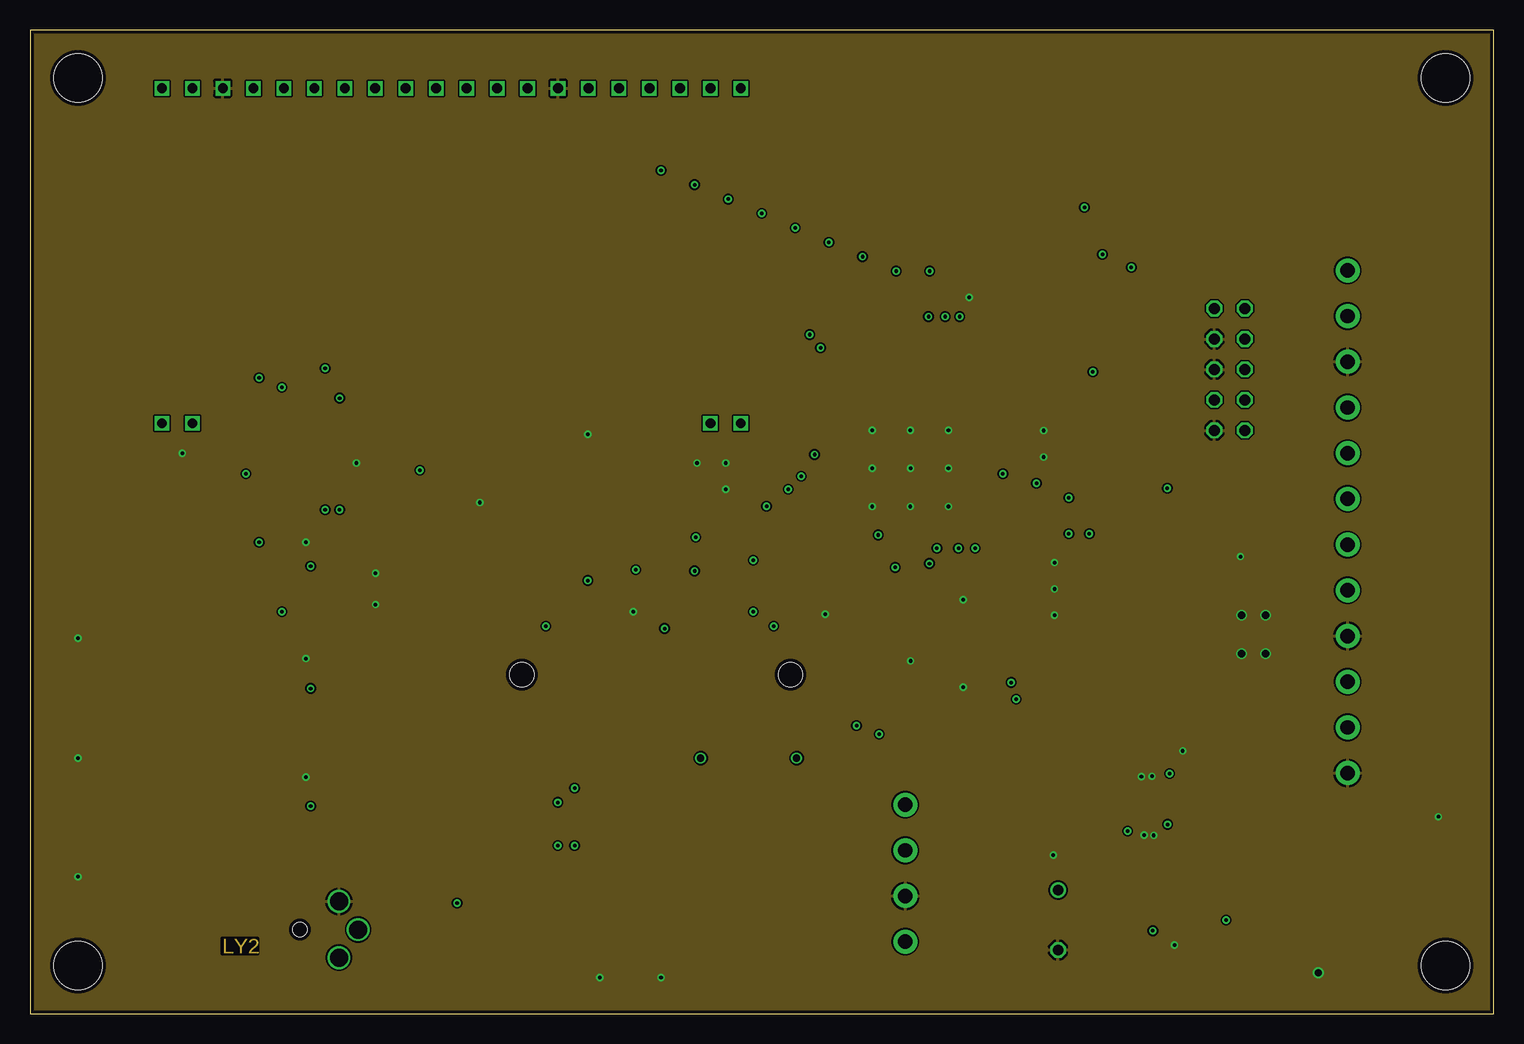
[diagram p5: board, inner layer Route2]
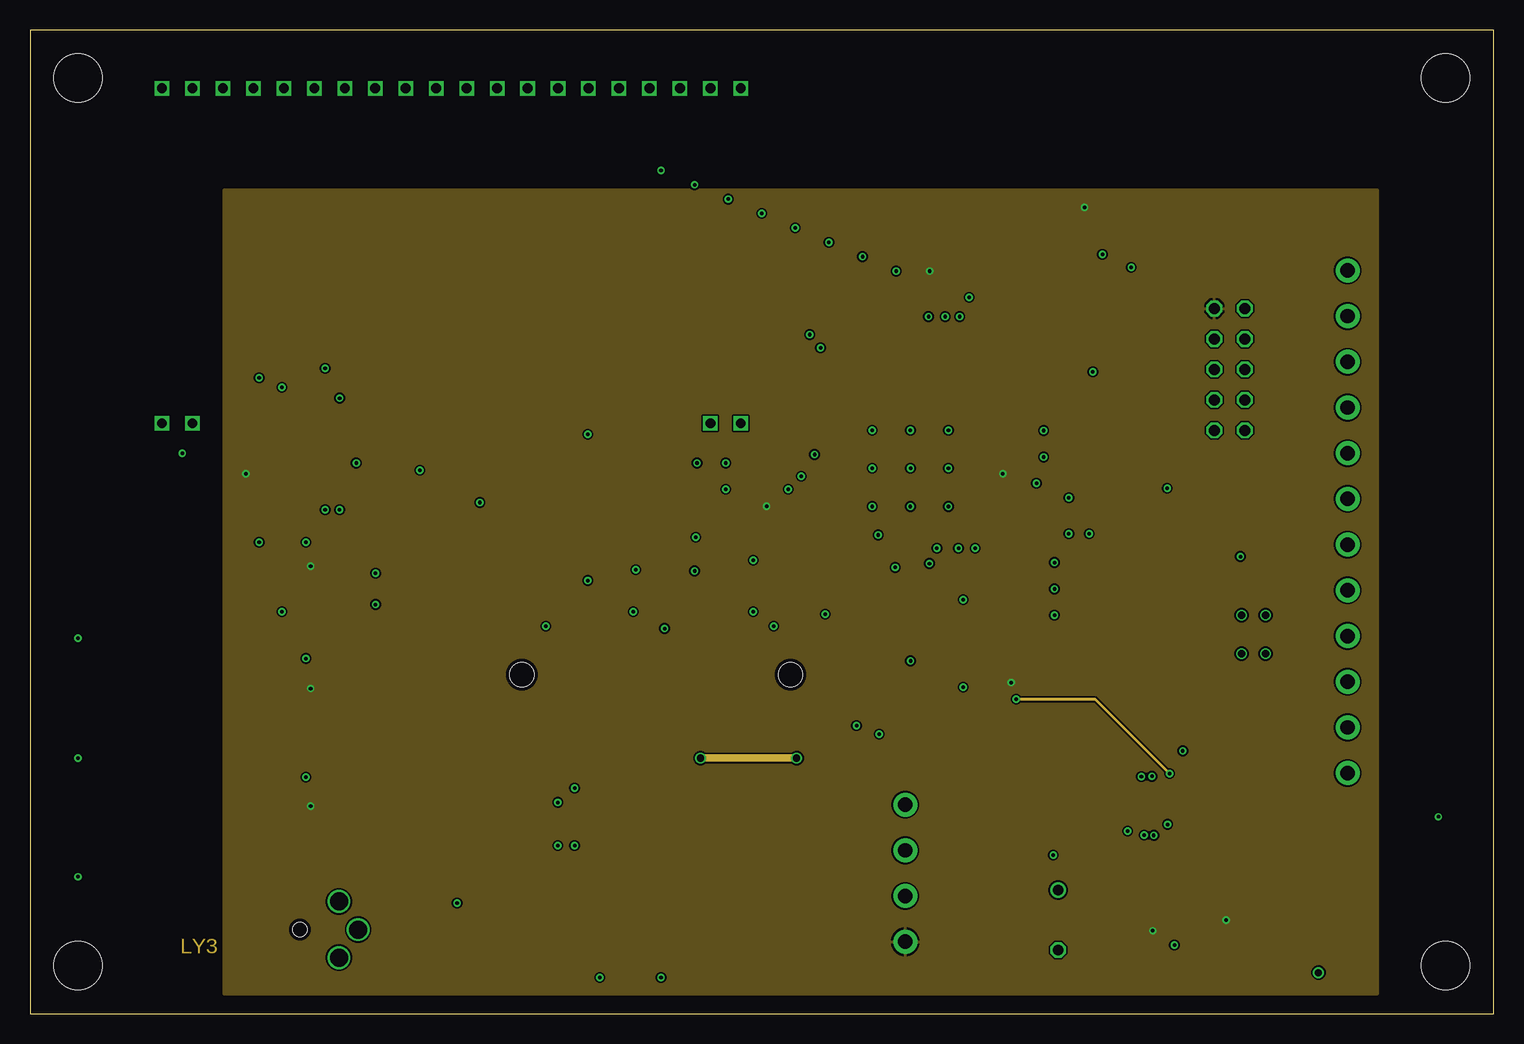
[diagram p6: board, inner layer Route3]
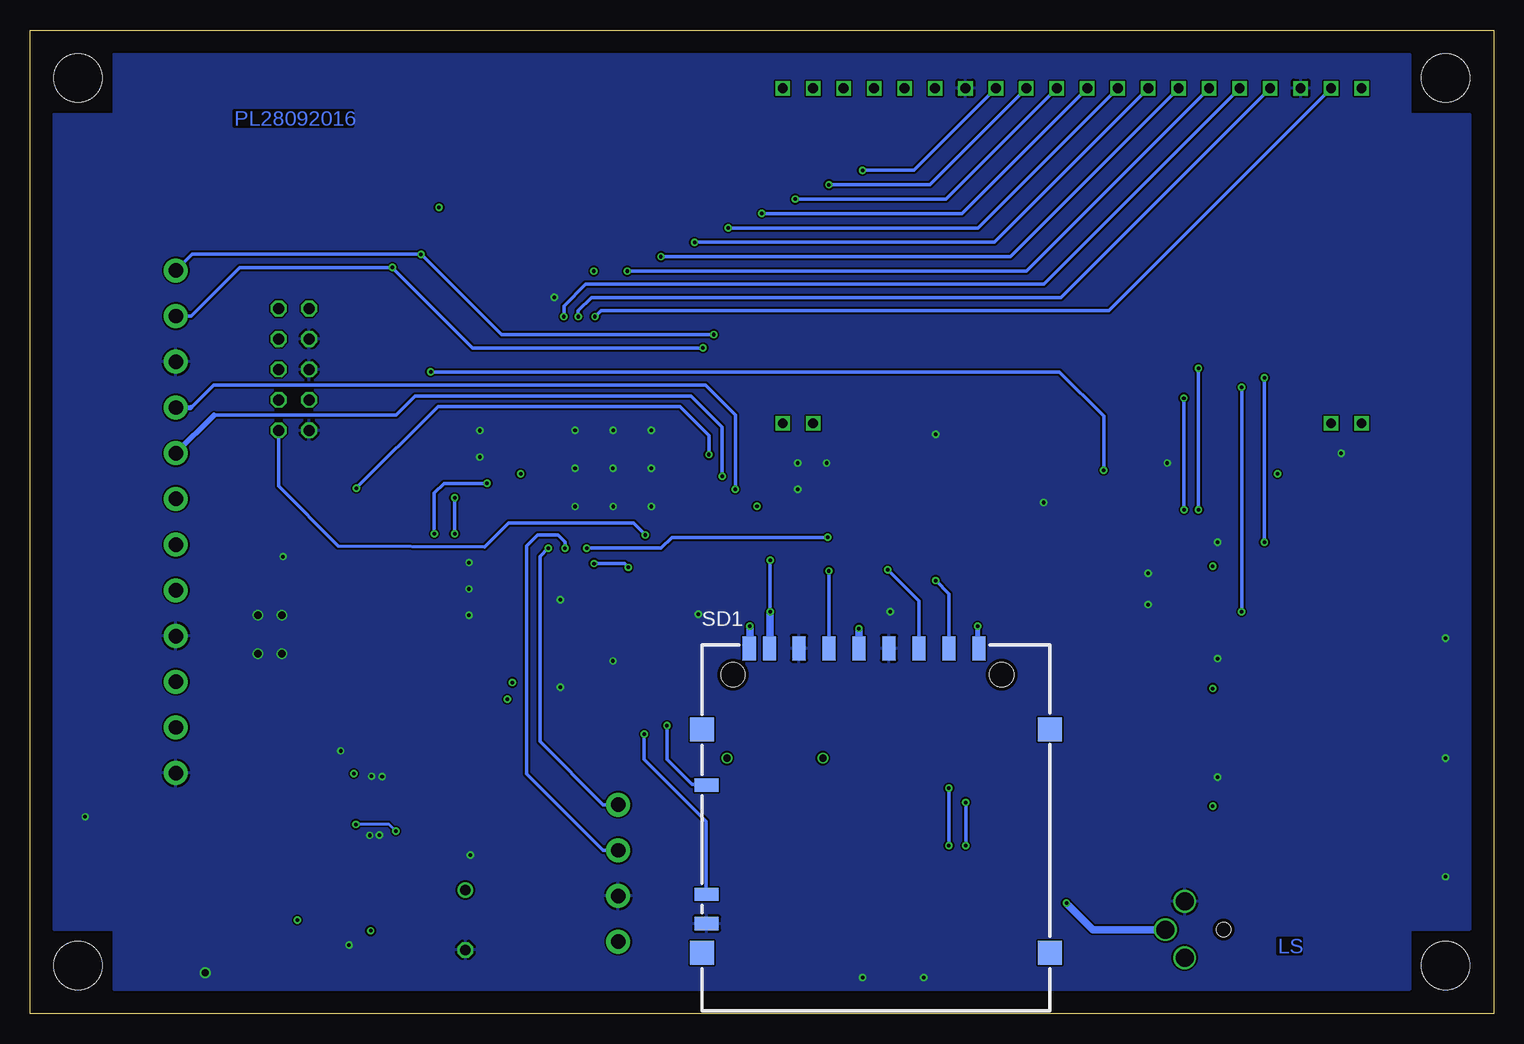
[diagram p7: board, bottom side, seen from below]

Size 122 x 82 mm. Coordinates in mm from the lower left corner, seen from the top.
Outline: 0,0 122,0 122,82 0,82 0,0
Copper layers (1+2*3+16): Top 0.035mm / dielectric 0.2mm / Route2 0.035mm / dielectric 1mm / Route3 0.035mm / dielectric 0.2mm / Bottom 0.035mm
Design rules "PCB-POOL Standard *": minimum track width 0.15mm, minimum drill 0.3mm, track to track 0.15mm, track to pad 0.15mm, pad to pad 0.15mm, via to via 0.15mm, smd to smd 0.15mm, copper to edge 0.3mm, drill to drill 0.2mm, minimum pad ring 0.2mm, minimum via ring 0.15mm, stop-mask expansion 0.075mm, vias tented up to drill 0mil, thermal gap 0.2mm
Holes 4 mm at 4,4 4,78 118,78 118,4

### Footprints (pad centres in the part's own frame; a part is rotated, then mirrored left to right if it is on the bottom)
PANASONIC_E = smd 3.8 x 1.4: + 3,0; - -3,0
C1206 = smd 1.6 x 1.8: 1 -1.4,0; 2 1.4,0
GOLDCAPSPK-V = drill 0.9: + -2.5,0 | drill 0.9 octagon: - 2.5,0
C0805 = smd 1.3 x 1.5: 1 -0.95,0; 2 0.95,0
C0603 = smd 1.1 x 1: 1 -0.85,0; 2 0.85,0
SOT-23@1 = smd 0.787 x 0.889: 1 0.025,-1.016; 2 -0.94,1.016; 3 0.991,1.016
DSG_PWSO-N8_EXP = smd 0.2 x 0.4: 1 -0.75,-0.85; 2 -0.25,-0.85; 3 0.25,-0.85; 4 0.75,-0.85; 5 0.75,0.85; 6 0.25,0.85; 7 -0.25,0.85; 8 -0.75,0.85 | smd 1.6 x 0.9: EXP 0,0
QFN64 = smd 0.85 x 0.3: 1 -4.45,3.75; 2 -4.45,3.25; 3 -4.45,2.75; 4 -4.45,2.25; 5 -4.45,1.75; 6 -4.45,1.25; 7 -4.45,0.75; 8 -4.45,0.25; 9 -4.45,-0.25; 10 -4.45,-0.75; 11 -4.45,-1.25; 12 -4.45,-1.75; 13 -4.45,-2.25; 14 -4.45,-2.75; 15 -4.45,-3.25; 16 -4.45,-3.75; 33 4.45,-3.75; 34 4.45,-3.25; 35 4.45,-2.75; 36 4.45,-2.25; 37 4.45,-1.75; 38 4.45,-1.25; 39 4.45,-0.75; 40 4.45,-0.25; 41 4.45,0.25; 42 4.45,0.75; 43 4.45,1.25; 44 4.45,1.75; 45 4.45,2.25; 46 4.45,2.75; 47 4.45,3.25; 48 4.45,3.75 | smd 0.3 x 0.85: 17 -3.75,-4.45; 18 -3.25,-4.45; 19 -2.75,-4.45; 20 -2.25,-4.45; 21 -1.75,-4.45; 22 -1.25,-4.45; 23 -0.75,-4.45; 24 -0.25,-4.45; 25 0.25,-4.45; 26 0.75,-4.45; 27 1.25,-4.45; 28 1.75,-4.45; 29 2.25,-4.45; 30 2.75,-4.45; 31 3.25,-4.45; 32 3.75,-4.45; 49 3.75,4.45; 50 3.25,4.45; 51 2.75,4.45; 52 2.25,4.45; 53 1.75,4.45; 54 1.25,4.45; 55 0.75,4.45; 56 0.25,4.45; 57 -0.25,4.45; 58 -0.75,4.45; 59 -1.25,4.45; 60 -1.75,4.45; 61 -2.25,4.45; 62 -2.75,4.45; 63 -3.25,4.45; 64 -3.75,4.45 | smd 7.2 x 7.2: 65 0,0
LUMBERG1502_01 = drill 1.5: P$1 -2.35,0.75; P$2 0,2.35; P$3 2.35,0.75 | hole 1.2: 0,-2.5
LPS3008 = smd 0.63 x 3.3: 1 -1.335,0; 2 1.335,0
0805 = smd 1.2 x 1: 1 -1.2,0; 2 1.2,0
EA_DOGM = drill 0.813 square: 1 0,0; 2 2.54,0; 19 45.72,0; 20 48.26,0; 21 48.26,27.94; 22 45.72,27.94; 23 43.18,27.94; 24 40.64,27.94; 25 38.1,27.94; 26 35.56,27.94; 27 33.02,27.94; 28 30.48,27.94; 29 27.94,27.94; 30 25.4,27.94; 31 22.86,27.94; 32 20.32,27.94; 33 17.78,27.94; 34 15.24,27.94; 35 12.7,27.94; 36 10.16,27.94; 37 7.62,27.94; 38 5.08,27.94; 39 2.54,27.94; 40 0,27.94
CHIPLED_0805 = smd 1.2 x 1.2: A 0,-1.05; C 0,1.05
ROUND2_1.5MM = smd 1.5 x 1.5: FID 0,0
TRANSISTOR-FET_1212-8S = smd 0.8 x 0.34: 1 -1.435,0.97; 2 -1.435,0.325; 3 -1.435,-0.325; 4 -1.435,-0.975; 5 1.435,-0.975; 6 1.435,-0.325; 7 1.435,0.325; 8 1.435,0.975 | smd 0.3 x 0.8: 9 -0.2,-1.225; 10 -0.2,1.25 | smd 1.7 x 2.1: 11 0.5,-0.015
CRYSTAL2P5.0X3.2 = smd 1.8 x 2.4: 1 -1.9,0; 2 1.9,0
CRYSTAL2P3.2X1.5 = smd 1 x 1.8: 1 -1.25,0; 2 1.25,0
R0805 = smd 1.3 x 1.5: 1 -0.95,0; 2 0.95,0
DTSM-6 = smd 1.55 x 1.3: 1 -3.975,2.25; 2 3.975,2.25; 3 -3.975,-2.25; 4 3.975,-2.25
DM1AA-SF-PEJ = smd 1.1 x 2: 1 6.1,14.95; 2 3.6,14.95; 3 1.1,14.95; 4 -1.4,14.95; 5 -3.9,14.95; 6 -6.4,14.95; 7 -8.85,14.95; 8 -10.55,14.95; 9 8.6,14.95 | smd 2 x 1.1: CDS -14.1,3.55; COM -14.1,-8; WPS -14.1,-5.566 | smd 2 x 2: G1 -14.5,8.2; G2 -14.5,-10.45; G3 14.5,-10.45; G4 14.5,8.2 | hole 2: -11.9,12.75; 10.5,12.75
ML10 = drill 0.914 octagon: 1 -5.08,-1.27; 2 -5.08,1.27; 3 -2.54,-1.27; 4 -2.54,1.27; 5 0,-1.27; 6 0,1.27; 7 2.54,-1.27; 8 2.54,1.27; 9 5.08,-1.27; 10 5.08,1.27
ZETEX_SOT-23 = smd 0.787 x 0.889: 1 0.025,-1.016; 2 -0.94,1.016; 3 0.991,1.016
SOT-23 = smd 0.787 x 0.889: 1 0.025,-1.016; 2 -0.94,1.016; 3 0.991,1.016
1803523 = drill 1.2 pad 2: 1 -20.955,0.635; 2 -17.145,0.635; 3 -13.335,0.635; 4 -9.525,0.635; 5 -5.715,0.635; 6 -1.905,0.635; 7 1.905,0.635; 8 5.715,0.635; 9 9.525,0.635; 10 13.335,0.635; 11 17.145,0.635; 12 20.955,0.635
1803442 = drill 1.2 pad 2: 1 -5.715,0.635; 2 -1.905,0.635; 3 1.905,0.635; 4 5.715,0.635

### Placement (x,y rotation side)
C1  98.6,31.6 180 top
C2  93.2,21.9 0 top
C3  97.1,13.7 180 top
C4  85.7,7.8 270 top
C5  107.4,9.3 90 top
C6  31.8,35.4 0 top
C7  115,16.4 0 top
C8  44.1,48.3 0 top
C9  98.3,5.7 0 top
C10  67.7,29.9 270 top
C11  82,48.6 180 top
C12  75.3,30.4 90 top
C13  67.7,34.3 90 top
C14  60.5,43.7 0 top
C15  78.8,33.2 0 top
C16  82,46.39 180 top
C17  71.6,30.4 90 top
C18  64.9,34.3 90 top
C19  83,33.2 180 top
C20  75.9,59.7 180 top
C21  83,35.4 180 top
C22  60.5,45.9 0 top
C23  83,37.6 180 top
C24  78.8,31 0 top
C25  78.8,28.6 0 top
C26  21,39.3 180 top
C27  21,29.6 180 top
C28  21,19.7 180 top
C29  38.4,44 180 top
C30  52.2,33.5 180 top
C31  12.7,44.8 90 top
C32  58,74 180 top
C33  50.4,74 180 top
D1  101.7,13.7 90 top
D2  35.8,28.5 180 top
D3  99.7,9.8 0 top
IC1  93.15,17.75 270 top
IC2  73.4,45.45 0 top
J1  25,7 270 top
L1  97.5,17.7 270 top
L2  83,28.6 0 top
LCD1  11,49.2 0 top
LED1  45,3 270 top
LED2  55,3 90 top
PASS1  10,5 0 top
PASS2  112,78 0 top
Q1  102.5,24 0 top
Q2  73.4,34.3 180 top
Q3  66.3,37.7 180 top
R1  89.4,66.3 270 top
R2  91.8,66.3 270 top
R3  98.5,21.9 0 top
R4  44,7 270 top
R5  56,7 270 top
R6  88.5,21.9 0 top
R7  87.5,18.4 90 top
R8  85.2,16 90 top
R9  100.7,17.7 90 top
R10  90.1,14.2 270 top
R11  87.5,14.2 90 top
R12  93.6,9.3 90 top
R13  83,31 180 top
R14  54.1,40.6 270 top
R15  45.1,44 90 top
R16  54.1,44.9 270 top
R17  21,37.3 0 top
R18  47.6,44 270 top
R19  21,27.2 0 top
R20  21,17.3 0 top
R21  38.4,46.4 0 top
R22  5,32.7 180 top
R23  5,22.7 180 top
R24  5,12.8 180 top
R25  56.1,31 180 top
R26  35.6,11.9 270 top
R27  33,11.9 270 top
R28  43,35.4 90 top
R29  56.1,33.5 180 top
R30  86.6,47.5 90 top
R31  31.7,43.9 0 top
R32  19.8,44 90 top
R33  28.5,44.9 270 top
R34  22.2,44 270 top
R35  96.6,40 90 top
R36  99,40 90 top
R37  10.3,44.8 270 top
S1  13,35 0 top
S2  13,25 0 top
S3  13,15 0 top
SD1  51.5,15.5 0 bottom
SV1  100,53.7 270 top
T1  50.6,45 270 top
T2  42.1,44 270 top
T3  25,44.9 270 top
T4  15.8,44 270 top
T5  101.9,40 90 top
U$2  [MPIO-ICON]  7.26,63.3 90 top
X1  109.2,41 270 top
X2  73.6,11.7 90 top

### Tracks (layer width: path | path; a pad name or v marks a point on that pad's centre or on a via)
AVDD  (via drill 0.3)
  Top 0.305: IC2.27 74.65,37.85 v74.98,37.51 | IC2.23 72.65,37.72 v72.12,37.2
  Top 0.61: R13.2 C19.2 82,33.25 82,35.4 | v74.98,37.51 81.6,37.51 | 81.6,37.51 81.6,37.6 | 82,35.4 82,37.55 C23.2 81.96,37.51 81.6,37.51 | C21.2 82,35.4
  Bottom 0.305: v72.12,37.2 72.44,37.51 v74.98,37.51
BATT_INPUT
  pour Top: 102.28,26.08 102.28,21.64 112.16,21.64 112.2,25.9 108.5,25.98
GND  (via drill 0.3, 0.6)
  Top 0.254: IC1.1 93.13,18.5 93.14,18.49 IC1.EXP 93.15,14.73
  Top 0.406: R11.1 87.5,13.23 | 87.5,13.2 87.5,13.23 | 87.5,13.23 85.31,13.23 v85.3,13.2 85.3,14.96 R8.1 | 93.83,21.1 C2.2 | 12.6,45.75 C31.2 | 4,32 R22.2 | 3.98,22.4 3.98,22.7 R23.2 | 4,12 R24.2
  Top 0.61: C28.1 v23,19.7 | C27.1 v23,29.6 | C26.1 v23,39.3 | C19.1 C21.1 C23.1 v85.4,37.6 | v93.53,19.77 93.56,21.07 C2.2 | v4,31.3 4,32 | v4,11.4 4,12 | v117.4,16.4 C7.2 | C6.- v28.8,34.1 v28.8,36.7 | C1.- 103,31.6 | C9.1 v95.4,5.7 | v4,21.3 4,22.65 R23.2 | LED1.C v47.5,3 | v52.6,3 LED2.C | T3.2 26.08,45.9 v27.2,45.9 28.25,45.9 R33.1 | v12.7,46.7 C31.2 | 12.6,45.75 12.6,45.7 10.35,45.7 R37.1 | C30.2 v50.3,33.5 | C12.1 75.25,29.4 v73.4,29.4 71.65,29.4 C17.1 | v78.3,59.7 C20.1 | R36.1 T5.2 100.9,39.04 v100.9,38.1 | v85.4,35.4 83.9,35.4 | v85.4,33.2 83.9,33.2 | v84.5,46.4 C16.1 | v84.5,48.6 C11.1 | C14.1 v58,43.7 | C22.1 v58,45.9 | C13.1 67.7,33.3 | 67.7,33.3 v66.3,33.3 64.9,33.3 C18.1 | v77.8,27.2 77.8,28.5 | 77.8,28.5 77.8,31.2 | 77.8,31.2 77.8,33.1 | 77.8,33.1 v77.8,34.5 | C15.1 77.85,33.15 77.8,33.1 | C24.1 77.85,31.15 77.8,31.2 | C25.1 77.85,28.55 77.8,28.5 | 67.7,33.3 C10.1 | R21.1 37.5,46.35 37.5,44 C29.2 37.5,43.95 v37.5,42.6 | v55.6,45.9 54.15,45.9 R16.1 54.05,45.9 51.66,45.9 T1.2 51.6,45.96 | C8.2 v46.5,48.3 | v101,33.2 99.4,34.8 91.4,34.8 89.5,32.9 89.5,26.8 83.7,21 83.7,13.2
  Top 1.016: C5.- v107.4,3.4 | v101,30 v101,33.2 | v103,33.2 103,31.6 v103,30
  other vias: 70.22,48.62 73.39,48.62 76.56,48.62 73.4,45.45 76.56,45.45 70.22,45.45 70.22,42.27 76.56,42.27 73.39,42.27 92.87,14.88 92.65,19.75 93.68,14.85 96.1,21.9
  pour Top (no thermals): 95.09,12.59 92.4,12.59 92.4,16.3 92.8,16.3 92.8,19 92.2,19 92.2,20.5 93.2,20.5 93.18,22.76 97.65,22.76 98.2,22.76 98.2,20.8 94.2,20.8 94.2,19 93.5,19 93.5,16.3 94.19,16.29 94.2,15.3 95.09,14.41
  pour Bottom: 7,80 7,75 2,75 2,7 7,7 7,2 115,2 115,7 120,7 120,75 115,75 115,80
  pour Route2: 0.3,81.7 121.7,81.7 121.7,0.3 0.3,0.3
LCD_+3.3V
  Top 0.61: 46.52,79.11 11.79,79.11 11,78.31 LCD1.40 11,73.7 7.8,70.5 7.8,44.6 8.4,44 10.45,44 | 46.52,79.11 49.16,79.11 | LCD1.26 46.56,79.1 46.5,79.1 46.52,79.11 | 49.16,79.11 49.1,79.1 LCD1.25 49.1,74.1 C33.2 | 49.16,79.11 52.7,79.11 52.7,79.1 53.4,79.1 54.18,78.32 LCD1.23 | T4.1 14.72,43.98 14.7,44 12.75,44 C31.1 12.7,44 10.45,44 | 10.45,44 R37.2
MCU_RESET  (via drill 0.3)
  Top 0.305: IC2.20 71.15,40.35 v70.7,39.9 69.3,38.5 69.3,29.6 68.65,28.95 C10.2 67.7,27 66.8,26.1 63.4,26.1 53.8,16.5 32.8,16.5 31.6,15.3 20.7,15.3 20.1,15.9 20.1,17.25 R20.1
  Top 0.61: S3.2 17.02,17.3 R20.1 20.2,17.45 20.2,19.7 C28.2
  Top 1.016: S3.1 S3.2
  Bottom 0.305: v70.7,39.9 71.7,40.9 82.1,40.9 84.1,38.9 96.3,39 101.27,43.97 SV1.10
N$1
  Top 0.305: R6.1 87.5,21.9 R7.2 87.55,19.3 89.2,19.3 91,17.5 IC1.3
N$2
  Top 0.61: R35.2 96.64,40.99 T5.3 99.04,40.99 R36.2
N$3
  Top 0.61: L2.2 84.1,28.6 | 84.1,28.6 84.1,28.5 | 84.1,28.6 84.1,30.85 R13.1
N$4
  Top 0.61: T2.3 45.06,43.01 R15.1 45.1,43 47.55,43 R18.2
N$5
  Top 0.305: 85.2,17 85.25,17 87.5,17 R7.1 87.95,17 IC1.4
  Top 0.406: 85.25,17 R8.2
N$6
  Top 0.406: R34.2 R32.1
  Top 0.61: T4.3 19.76,43.01 R32.1
N$7
  Top 0.61: T1.1 49.58,44.98 49.6,45 47.65,45 R18.1
N$9
  Top 0.254: IC1.7 95.5,18 96,18.5 96,19 97.47,19 L1.1
N$10
  Top 0.61: T3.1 23.98,44.88 24,44.9 22.25,44.9 R34.1
N$11
  Top 0.61: T1.3 51.69,44.01 51.7,44 54.05,44 R16.2 R14.1
N$12
  Top 0.61: T3.3 28.26,43.91 R33.2 28.3,43.9 | 28.3,43.8 28.3,43.9 | 28.3,43.9 R31.1
N$13
  Top 0.305: IC1.2 91.8,18 91.5,18.3
  Top 0.61: 91.5,18.3 91.5,21.6 C2.1 R6.2
  pour Top (no thermals): 101.6,23.6 101.6,26.1 97.6,30.1 97.6,33.3 91.7,33.3 91.7,27.5 88.8,24.6 88.8,21.2 92.5,21.2 92.5,23.6
N$16  (via drill 0.3)
  Top 0.61: R28.1 v43,32.3
  Bottom 0.406: SD1.9 43,30.64 v43,32.3
N$17
  Top 0.61: LED2.A 56,3 R5.2
N$18  (via drill 0.3)
  Top 0.61: R25.1 60.7,31 v62,32.3
  Bottom 0.61: SD1.8 62.05,30.55 62,30.6 v62,32.3
N$19  (via drill 0.3)
  Top 0.254: IC1.5 94.5,17 94.83,16.68 v94.83,15.77 | 90.1,15.2 90.15,15.27 R10.1 | 87.5,15.19 R11.2
  Top 0.406: v91.5,15.2 90.1,15.2 | R10.1 90.05,15.2 88,15.2 87.5,15.19
  Bottom 0.254: v94.83,15.77 94.8,15.8 92.1,15.8 v91.5,15.2
N$20
  Top 0.305: Q1.4 100.42,23.02 99.45,22.05 R3.2
N$21
  Top 0.61: C4.+ 93.6,10.3 R12.2 98.19,10.25 D3.2
N$23
  Top 0.406: 5.96,32.67 R22.1 9.03,32.7 S1.3
  Top 1.016: S1.3 S1.4
N$24
  Top 0.406: R23.1 9.1,22.7 9.1,22.75 S2.3
  Top 1.016: S2.3 S2.4
N$25
  Top 0.61: LCD1.22 56.72,74.23 C32.2
N$26
  Top 0.406: S3.3 8.86,12.79 R24.1
  Top 1.016: S3.3 S3.4
N$27
  Top 0.61: LCD1.21 59.26,74.41 C32.1
N$28
  Top 0.61: LCD1.24 51.64,74.16 C33.1
N$29
  Top 0.406: 44,2.9 43.9,2.9 LED1.A
  Top 0.61: LED1.A 43.95,2.95 44,2.9 R4.2
N$30
  Top 0.305: IC2.40 78.6,45.2 79.4,46 79.4,48.1 79.9,48.6 C11.2
PA0_SMBUS_SDA  (via drill 0.3)
  Top 0.305: IC2.1 68.5,49.2 65.9,51.8 v65.9,55.5 | R2.2 v91.8,62.2
  Bottom 0.305: v65.9,55.5 85.1,55.5 v91.8,62.2 104.51,62.2 108.56,58.15 X1.2
PA1_SMBUS_SCL  (via drill 0.3)
  Top 0.305: IC2.2 68.1,48.7 65,51.8 v65,56.6 | v89.4,63.3 R1.2
  Bottom 0.305: v65,56.6 82.7,56.6 v89.4,63.3 108.49,63.3 X1.1
PA2_POWER_LED  (via drill 0.3)
  Top 0.305: IC2.3 67.67,48.2 62.07,53.8 v24.6,53.8 | R4.1 v44,14 | v44,17.6 36,17.6 24.6,29 v24.6,42
  Bottom 0.305: v44,14 v44,17.6 | v24.6,42 v24.6,53.8
PA3_KEY_S1  (via drill 0.3)
  Top 0.305: IC2.4 67.23,47.7 61.93,53 v19.1,53
  Top 0.406: R17.1 20.05,37.57
  Top 0.61: S1.2 16.98,37.27 17,37.3 R17.1 | 20.05,37.57 20.17,37.57 20.2,37.6 20.2,39.25 C26.2 v19.1,39.3
  Top 1.016: S1.2 S1.1
  Bottom 0.305: v19.1,39.3 v19.1,53
PA4_KEY_S2  (via drill 0.3)
  Top 0.305: IC2.5 66.78,47.2 61.78,52.2 v21,52.2 | C27.2 20.2,29.6 20.2,32.7 v21,33.5
  Top 0.406: 20.05,26.72 R19.1 | 17.02,27.2 S2.2
  Top 0.61: 17.02,27.2 R19.1 20.2,27.2 20.2,29.55 C27.2
  Top 1.016: S2.1 S2.2
  Bottom 0.305: v21,33.5 v21,52.2
PA5_LOG_FLUSH_LED  (via drill 0.3)
  Top 0.305: v25.81,51.3 61.7,51.3 66.3,46.7 IC2.6 | R5.1 51.45,7.95 v45.4,14 | v45.4,18.8 36,18.8 25.8,29 v25.8,42
  Bottom 0.305: v45.4,14 v45.4,18.8 | v25.8,42 v25.8,51.29 v25.81,51.3
PA6_RFID_POWER  (via drill 0.3)
  Top 0.305: R35.1 96.55,39.1 96.2,39.1 94.8,40.5 v94.8,43.8 | IC2.7 65.8,46.2 v65.4,46.6
  Bottom 0.305: v65.4,46.6 65.4,48.2 67.8,50.6 88,50.6 v94.8,43.8
PB7_LFXTAL_P
  Top 0.305: IC2.15 67.92,42.2 65.65,39.93 65.1,39.38 65.1,37.8 Q3.2 65.05,35.25 C18.2
PB8_LFXTAL_N
  Top 0.305: IC2.16 68.6,41.7 67.6,40.7 67.6,37.75 Q3.1 67.55,35.25 C13.2
PB11_POWER_GOOD  (via drill 0.3)
  Top 0.254: R9.2 100.7,19.5 100.2,20 v95,20 95,19 94.5,18.5 IC1.8
  Top 0.305: IC2.21 71.65,38.95 69.9,37.2 69.9,27.5 71.2,26.2 v82.2,26.2
  Route3 0.254: v95,20 88.8,26.2 v82.2,26.2
PB13_HFXTAL_P
  Top 0.305: IC2.24 73.15,36.45 71.8,35.11 71.8,34.97 Q2.2 | Q2.2 71.8,34.34 | C17.2 71.6,34.2 Q2.2
PB14_HFXTAL_N
  Top 0.305: IC2.25 73.65,36.45 74.98,35.11 74.98,34.97 Q2.1 | Q2.1 74.98,34.34 | 75.3,31.3 C12.2 Q2.1
PC0_RFID_RX  (via drill 0.3)
  Top 0.305: IC2.9 64.7,45.2 v64.3,44.8
  Bottom 0.305: 106.65,49.9 91.5,49.9 89.9,51.5 66.9,51.5 64.3,48.9 v64.3,44.8
  Bottom 0.406: X1.5 106.65,49.9
PC1_RFID_TX  (via drill 0.3)
  Top 0.305: IC2.10 65.3,44.7 64.3,43.7 v63.2,43.7
  Bottom 0.305: v63.2,43.7 63.2,49.9 65.7,52.4 106.69,52.4 108.56,50.52
  Bottom 0.406: X1.4 108.56,50.52
PC2_SD_SDO  (via drill 0.3)
  Top 0.305: IC2.11 65.78,44.2 62.58,41 61.7,41 58.9,38.2 51.7,38.2 v50.5,37
  Bottom 0.305: 48,30.22 SD1.2 47.9,34.4 v50.5,37
PC3_SD_SDI  (via drill 0.3)
  Top 0.305: IC2.12 66.19,43.7 60.39,37.9 v60.3,37.8
  Top 0.61: R29.1 v60.3,33.5
  Bottom 0.305: v60.3,33.5 v60.3,37.8
  Bottom 0.61: SD1.7 60.3,30.5 v60.3,33.5
PC4_SD_CLK  (via drill 0.3)
  Top 0.305: IC2.13 67.01,43.2 60.71,36.9 v55.4,36.9
  Bottom 0.305: 55.4,30.4 SD1.5 v55.4,36.9
PC5_SD_CS  (via drill 0.3)
  Top 0.305: IC2.14 67.47,42.7 62.06,37.3 61.2,36.4 60.9,36.1 v46.5,36.1
  Bottom 0.305: SD1.1 45.4,35 v46.5,36.1
PC6_SD_CD  (via drill 0.3)
  Top 0.305: IC2.37 81.19,43.7 81.89,43 v86.6,43 R30.1 | v68.9,24 84.2,24 87.6,27.4 87.6,39 v86.6,40
  Bottom 0.305: 65.96,18.88 66.02,18.98 | 66.02,18.98 SD1.CDS | 66.02,18.98 66.02,19.08 66,19.1 66.8,19.1 68.9,21.2 v68.9,24 | v86.6,40 v86.6,43
  Bottom 0.406: 65.63,19 SD1.CDS
PC7_SD_WP  (via drill 0.3)
  Top 0.305: IC2.38 v83.9,44.2 | v70.8,23.3 84.6,23.3 88.3,27 v88.3,40
  Bottom 0.305: SD1.WPS 65.63,9.9 65.63,16.03 70.8,21.2 v70.8,23.3 | v83.9,44.2 87.5,44.2 88.3,43.4 v88.3,40
PC12_SD_PULLUP
  Top 0.305: IC2.45 78.5,47.7 78.8,48 78.8,49.4 79.5,50.1 86.1,50.1 86.6,49.6 R30.2
PD0_SD_POWER  (via drill 0.3)
  Top 0.305: IC2.28 75.15,39.34 75.16,39.24 v75.6,38.8 | R14.2 54.45,39.65 54.5,39.7 v55.5,39.7
  Bottom 0.305: v55.5,39.7 68.5,39.7 69.4,38.8 v75.6,38.8
PD1_DCF77_ENABLE  (via drill 0.3)
  Top 0.305: IC2.29 75.65,40.05 76.9,38.8 v77.4,38.8
  Bottom 0.305: v77.4,38.8 77.4,39.3 78,39.9 79.7,39.9 80.6,39 80.6,19.97 74.23,13.61 X2.3
PD2_DCF77_SIGNAL  (via drill 0.3)
  Top 0.305: IC2.30 76.15,40.45 76.9,39.7 77.9,39.7 v78.8,38.8
  Bottom 0.305: v78.8,38.8 79.5,38.1 79.5,22.68 74.23,17.41 X2.4
PD4_LEUART_TX
  Top 0.305: IC2.32 78.9,41 80.3,39.6 84.7,39.6 86.2,38 86.2,28.1 83.5,25.4 63.9,25.4 54.2,15.7 34.6,15.7 33,14.1 R27.1
PD5_LEUART_RX
  Top 0.305: IC2.33 79.3,41.7 80.7,40.3 85,40.3 86.9,38.4 86.9,27.7 83.9,24.7 64.3,24.7 54.6,15 36.2,15 35.6,14.4 R26.1
PD6_LB_OUTER
  Top 0.305: IC2.34 79.8,42.2 80.99,41.01 90.19,41.01 94.8,36.4 108.72,36.4 X1.8
PD7_LB_INNER
  Top 0.305: IC2.35 80.25,42.7 81.31,41.64 90.76,41.64 95.3,37.1 107.84,37.1 X1.7
PD8_LCD_POWER  (via drill 0.3)
  Top 0.305: v88.6,53.5 88.6,43.4 87.51,42.31 81.64,42.31 80.75,43.2 IC2.36 | v32.5,45.3 32.5,43.75 R31.2
  Bottom 0.305: v88.6,53.5 36.2,53.5 32.5,49.8 v32.5,45.3
PE8_LCD_D0  (via drill 0.3)
  Top 0.254: IC2.56 73.65,60.45 v72.2,61.9
  Bottom 0.305: v72.2,61.9 38.94,61.9 LCD1.35
PE9_LCD_D1  (via drill 0.3)
  Top 0.254: IC2.57 73.15,59.35 v69.4,63.1
  Bottom 0.305: v69.4,63.1 40.28,63.1 LCD1.34
PE10_LCD_D2  (via drill 0.3)
  Top 0.254: IC2.58 72.65,58.25 v66.6,64.3
  Bottom 0.305: v66.6,64.3 41.62,64.3 LCD1.33
PE11_LCD_D3  (via drill 0.3)
  Top 0.254: IC2.59 72.15,57.15 v63.8,65.5
  Bottom 0.305: v63.8,65.5 42.96,65.5 LCD1.32
PE12_LCD_D4  (via drill 0.3)
  Top 0.254: IC2.60 71.65,56.05 v61,66.7
  Bottom 0.305: v61,66.7 44.3,66.7 LCD1.31
PE13_LCD_D5  (via drill 0.3)
  Top 0.254: IC2.61 71.15,54.95 v58.2,67.9
  Bottom 0.305: v58.2,67.9 45.64,67.9 LCD1.30
PE14_LCD_D6  (via drill 0.3)
  Top 0.254: IC2.62 70.65,53.85 v55.4,69.1
  Bottom 0.305: v55.4,69.1 46.98,69.1 LCD1.29
PE15_LCD_D7  (via drill 0.3)
  Top 0.254: IC2.63 70.15,52.75 v52.6,70.3
  Bottom 0.305: v52.6,70.3 48.32,70.3 LCD1.28
PF0_DBG_SWCLK
  Top 0.305: IC2.49 77.14,50.15 77.14,50.54 81.6,55 100.03,55 SV1.4
PF1_DBG_SWDIO
  Top 0.305: IC2.50 76.64,50.6 76.64,51.04 83.1,57.5 99.99,57.5 SV1.2
PF2_DBG_SWO
  Top 0.305: IC2.51 76.15,51.45 85.5,60.8 102.5,60.8 103.7,59.6 103.7,56.13 SV1.6
PF3_LCD_ENABLE  (via drill 0.3)
  Top 0.305: IC2.52 75.65,51.95 77.5,53.8 v77.5,58.1
  Bottom 0.305: LCD1.36 37.5,60.8 75.7,60.8 77.5,59 v77.5,58.1
PF4_LCD_RW  (via drill 0.3)
  Top 0.305: IC2.53 75.15,52.55 76.3,53.7 v76.3,58.1
  Bottom 0.305: LCD1.37 36.06,59.7 75.2,59.7 76.3,58.6 v76.3,58.1
PF5_LCD_RS  (via drill 0.3)
  Top 0.305: IC2.54 74.65,57.85 v74.9,58.1
  Bottom 0.305: LCD1.39 32.08,58.6 74.4,58.6 v74.9,58.1
RFID_GND
  Top 0.61: T5.1 106.95,40.02 X1.6
RXD_HOST
  Top 0.61: J1.P$3 30.25,4.65 33,7.4 R27.2
SD_+3.3V  (via drill 0.3)
  Top 0.61: v52.9,32.1 52.9,33.35 C30.1 | C30.1 52.9,33.65 52.9,34.4 52.3,35 45.8,35 44.45,36.35 R28.2 43,38.4 39.4,42 39.4,43.85 | R25.2 55.1,31 55.1,33.45 | 55.1,33.45 R29.2 | 55.1,33.45 55.1,33.5 C30.1 | 39.4,43.85 39.4,46.35 R21.2 | T2.1 41.08,43.98 41.1,44 C29.1 39.4,43.85
  Bottom 0.61: v52.9,32.1 52.9,30.5 52.8,30.5 SD1.4
TXD_HOST  (via drill 0.3)
  Top 0.61: v35.6,9.2 R26.2
  Bottom 0.61: J1.P$2 33.4,7 v35.6,9.2
V1  (via drill 0.6)
  Top 0.254: IC1.6 95.4,17.5 95.9,17 96.1,17 96.1,16.4 97.47,16.4 L1.2
  Top 0.406: 98.5,16.1 98.23,16.36 L1.2
  Top 0.61: D2.2 36.7,27.48 | 36.7,27.48 D2.3 | R10.2 90.1,11.7 | 90.1,11.7 97,11.7 98.2,12.9 98.2,13.9 98.5,14.2 | 90.1,11.7 80.4,11.7 78.7,13.4 78.7,20 77.4,21.3 v63.9,21.3 | v55.9,21.3 38.9,21.3 36.7,23.5 36.7,27.48
  Top 1.016: 100.68,13.6 D1.2 100.69,12.76 D3.3 | 100.68,13.6 D1.3 100.68,16.73 R9.1 | 100.68,13.6 100.58,13.7 C3.1 98.5,14.2 98.5,16.1
  Route3 0.61: v55.9,21.3 v63.9,21.3
VFRONT
  Top 1.016: 107.5,13.7 113,13.7 114.1,14.8 114.1,16.3 | C5.+ 107.5,13.7 | 107.5,13.7 102.74,13.7 D1.1 | 114.1,16.3 114.1,25.9 112.33,27.66 X1.10 | C7.1 114.05,16.35 114.1,16.3
VMCU  (via drill 0.3)
  Top 0.254: IC2.55 74.15,58.85 74.9,59.6 C20.2
  Top 0.305: 74.88,36.46 74.14,37.2 IC2.26 | IC2.8 65,45.7 64.8,45.9 | IC2.39 79.36,44.7 C16.2
  Top 0.406: 99.72,8.7 D3.1
  Top 0.61: 19.8,45 R32.2 19.75,45 v18,45 16.88,45 T4.2 | 74.88,36.46 79.04,36.46 79.7,35.8 79.7,33.2 | 21.95,27.04 R19.2 22.08,27.13 22.1,27.1 v23.4,27.1 | 21.95,37.33 R17.2 21.95,37.33 22,37.3 v23.4,37.3 | v23.4,17.3 22,17.3 21.95,17.33 R20.2 | 99.72,8.7 99.7,8.7 v99.7,7.8 C9.2 | R12.1 v93.6,6.9 | v75,61.9 75,59.5 C20.2 | v81.8,27.6 L2.1 C25.2 79.7,28.6 79.7,31 | v81.1,45 81.1,46.34 C16.2 | v87.9,67.2 89.4,67.2 | 89.4,67.2 91.75,67.2 R2.1 | R1.1 89.4,67.2 | 64.8,45.9 C22.2 61.4,45.9 61.4,43.75 C14.2 61.4,43.7 v61.4,42.3 | C15.2 79.7,33.2 | 79.7,33.2 79.7,31 | C24.2 79.7,31
  pour Route3: 16.2,68.7 112.3,68.7 112.3,1.6 16.2,1.6
VSD
  Top 0.61: D2.1 35.8,29.5 35.8,35.4 35.77,35.38 34.8,35.38 C6.+ 35.7,35.4 35.8,35.5 35.8,47.4 36.7,48.3 C8.1 43.15,44.97 T2.2 R15.2

### Text on the board
Top: PL28092016 | BS
Route2: LY2
Route3: LY3
Bottom: PL28092016 | LS
tPlace: APRDL_2016_4L | SMB_SCL | SMB_SDA | SMB_GND | RFID_TX | RFID_RX | RFID_ | GND | LB_ | INNEN | LB_ | AUSSEN | FRONT_ | GND | FRONT_ | VDD | BATT_ | INPUT | BATT_ | -GND
tNames: 1 | EA_DOGM126L_A | LB | AKKU | CLOCK | TRANS | 1 | SIGNAL | RESET | ENABLE | GND | VMCU